# EAGLE design CoreLogger_TopLoadMicro_CD (EAGLE 9.3.0)

## Sheet 1 of 2
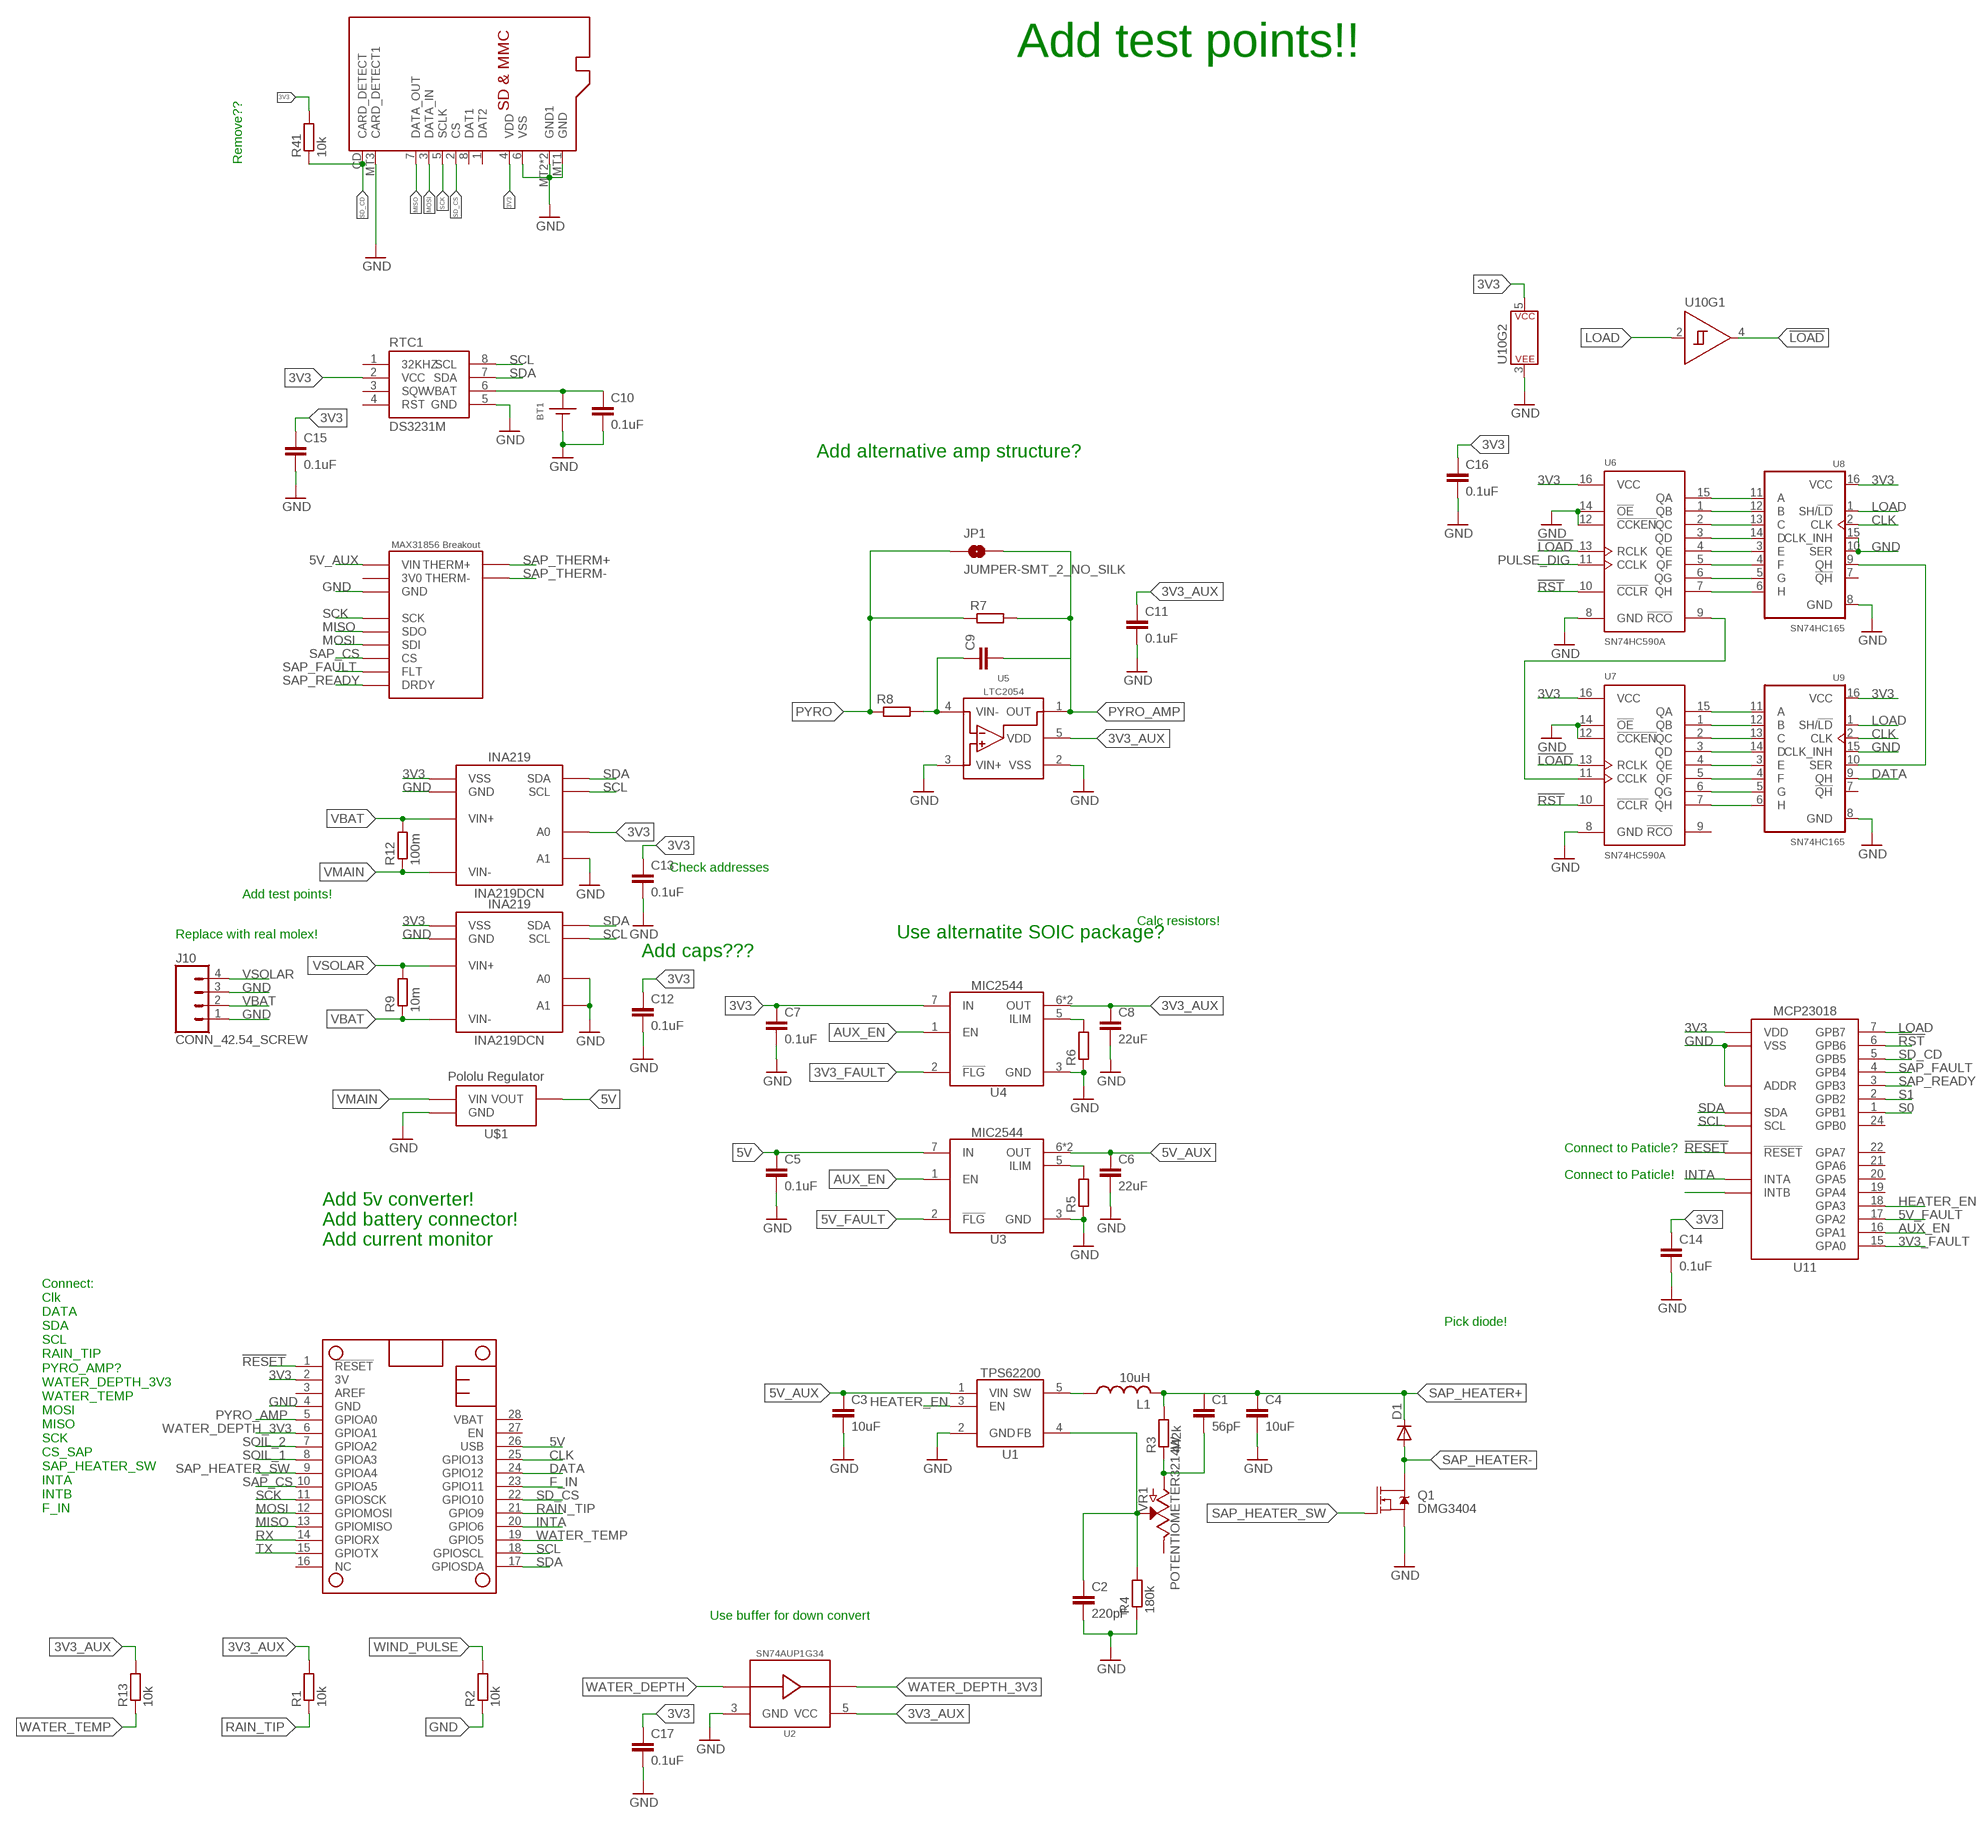
[diagram p0: schematic, sheet 1, part 1 of 2]
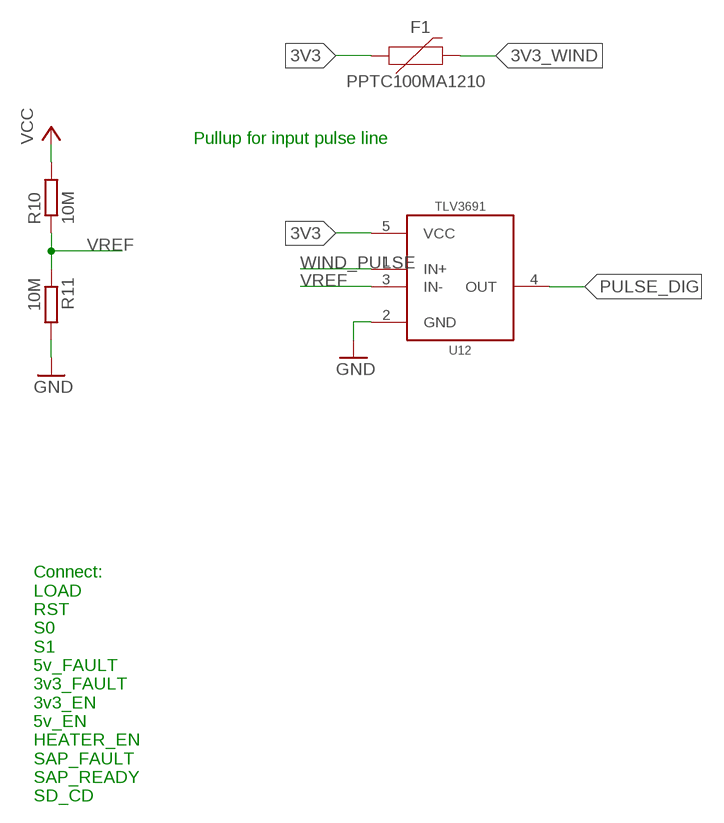
[diagram p1: schematic, sheet 1, part 2 of 2]

### Parts
BT1  BATTERY_COIN12MM  [LINX_BAT-HLD-012-SMT]
C1  56pF  C-EU56PFC0402  [C0402]
C2  220pF  C-EU220PFC0402  [C0402]
C3  10uF  C-EU10UFC0805  [C0805]
C4  10uF  C-EU10UFC0805  [C0805]
C5  0.1uF  C-EU0.1UFC0402  [C0402]
C6  22uF  C-EU22UFC0805  [C0805]
C7  0.1uF  C-EU0.1UFC0402  [C0402]
C8  22uF  C-EU22UFC0805  [C0805]
C9  C-EUC0603  [C0603]
C10  0.1uF  C-EU0.1UFC0603  [C0603]
C11  0.1uF  C-EU0.1UFC0402  [C0402]
C12  0.1uF  C-EU0.1UFC0402  [C0402]
C13  0.1uF  C-EU0.1UFC0402  [C0402]
C14  0.1uF  C-EU0.1UFC0402  [C0402]
C15  0.1uF  C-EU0.1UFC0402  [C0402]
C16  0.1uF  C-EU0.1UFC0402  [C0402]
C17  0.1uF  C-EU0.1UFC0402  [C0402]
D1  DIODESOD-123  [SOD-123]
F1  PPTC100MA1210  [1210_BOURNS]
J10  CONN_42.54_SCREW  [1X04_SCREW]
JP1  JUMPER-SMT_2_NO_SILK  [SMT-JUMPER_2_NO_SILK]
L1  10uH  INDUCTORLQS_4X4  [WE-LQS(4X4)]
MS1  FEATHERWING_NODIM  [FEATHERWING_DIM]
Q1  DMG3404  MOSFET-NCH-DMG3404L  [SOT23-3]
R1  10k  R-EU_10KR0603  [R0603]
R2  10k  R-EU_10KR0603  [R0603]
R3  442k  R-EU_R0603  [R0603]
R4  180k  R-EU_180KR0603  [R0603]
R5  R-EU_R0603  [R0603]
R6  R-EU_R0603  [R0603]
R7  R-EU_R0603  [R0603]
R8  R-EU_R0603  [R0603]
R9  10m  R-EU_R0805  [R0805]
R10  10M  R-EU_10MR0603  [R0603]
R11  10M  R-EU_10MR0603  [R0603]
R12  100m  R-EU_R0805  [R0805]
R13  10k  R-EU_10KR0603  [R0603]
R41  10k  R-EU_10KR0402  [R0402]
RTC1  DS3231M  [SO08]
SD1  MICROSDHINDGED  [MICROSD_HIROSE_HINDGED]
U1  TPS62200SOT23  [DBV0005A]
U2  SN74AUP1G34SC70  [DCK_R-PDSO-G5]
U3  MIC2544MSOP  [MSOP_8]
U4  MIC2544MSOP  [MSOP_8]
U5  LTC2054  [SOT23-5]
U6  SN74HC590AD  [SO16]
U7  SN74HC590AD  [SO16]
U8  SN74HC165D  [SO16]
U9  SN74HC165D  [SO16]
U10  SN74AUP1G14DCK  [DCK_R-PDSO-G5]
U11  MCP23018QFN  [QFN24]
U12  TLV3691DCK  [DCK_R-PDSO-G5]
U13  INA219DCN  [DCN_R-PDSO-G8]
U14  INA219DCN  [DCN_R-PDSO-G8]
U$1  POLOLU_REGULATOR  [U1V10FX_REGULATOR]
VR1  POTENTIOMETER3214W  [POT_3214W]
XU1  MAX31856_BREAKOUT  [MAX31856_BREAKOUT]

### Nets
3V3: C7.1 C12.1 C13.1 C14.1 C15.1 C16.1 C17.1 F1.1 MS1.2(3V) R10.2 R41.2 RTC1.2(VCC) SD1.4(VDD) U4.7(IN) U6.16(VCC) U7.16(VCC) U8.16(VCC) U9.16(VCC) U10.5(P$V+) U11.8(VDD) U12.5(VCC) U13.4(VSS) U14.4(VSS) U14.7(A0) ; supply symbol labelled VCC ; also sheet 2
3V3_AUX: C8.1 C11.1 R1.2 R13.2 U2.5(VCC) U4.6(OUT) U4.8(OUT) U5.5(VDD) ; also sheet 2
3V3_FAULT: U4.2(!FLG) U11.15(GPA0)
3V3_WIND: F1.2 ; also sheet 2
5V: C5.1 MS1.26(USB) U3.7(IN) U$1.VOUT
5V_AUX: C3.1 C6.1 U1.1(VIN) U3.6(OUT) U3.8(OUT) XU1.VIN ; also sheet 2
5V_FAULT: U3.2(!FLG) U11.17(GPA2)
!LOAD: U6.13(RCLK) U7.13(RCLK) U10.4(Y)
!RESET: MS1.1(!RESET) U11.12(!RESET)
!RST: U6.10(!CCLR) U7.10(!CCLR) U11.6(GPB6)
AUX_EN: U3.1(EN) U4.1(EN) U11.16(GPA1)
CLK: MS1.25(GPIO13) U8.2(CLK) U9.2(CLK)
DATA: MS1.24(GPIO12) U9.9(QH)
F_IN: MS1.23(GPIO11) ; also sheet 2
GND: BT1.GND(-) C2.2 C3.2 C4.2 C5.2 C6.2 C7.2 C8.2 C10.2 C11.2 C12.2 C13.2 C14.2 C15.2 C16.2 C17.2 J10.1 J10.3 MS1.4(GND) Q1.2(S) R2.1 R4.1 R5.1 R6.1 R11.2 RTC1.5(GND) SD1.6(VSS) SD1.MT1(GND) SD1.MT2(GND1) SD1.MT3(CARD_DETECT1) SD1.MT4(GND1) U1.2(GND) U2.3(GND) U3.3(GND) U4.3(GND) U5.2(VSS) U5.3(VIN+) U6.8(GND) U6.12(!CCKEN) U6.14(!OE) U7.8(GND) U7.12(!CCKEN) U7.14(!OE) U8.8(GND) U8.10(SER) U8.15(CLK_INH) U9.8(GND) U9.15(CLK_INH) U10.3(P$V-) U11.11(ADDR) U11.23(VSS) U12.2(GND) U13.3(GND) U13.7(A0) U13.8(A1) U14.3(GND) U14.8(A1) U$1.GND XU1.GND ; also sheet 2
HEATER_EN: U1.3(EN) U11.18(GPA3)
INTA: MS1.20(GPIO6) U11.14(INTA)
LOAD: U8.1(SH/!LD) U9.1(SH/!LD) U10.2(A) U11.7(GPB7)
MISO: MS1.13(GPIOMISO) SD1.7(DATA_OUT) XU1.SDO
MOSI: MS1.12(GPIOMOSI) SD1.3(DATA_IN) XU1.SDI
N$1: C1.2 R3.1 VR1.1(A)
N$2: C9.1 R8.2 U5.4(VIN-)
N$3: C2.1 R4.2 U1.4(FB) VR1.2(S)
N$4: R6.2 U4.5(ILIM)
N$5: R5.2 U3.5(ILIM)
N$6: L1.P$1 U1.5(SW)
N$7: U7.15(QA) U9.11(A)
N$8: U7.1(QB) U9.12(B)
N$9: U7.2(QC) U9.13(C)
N$10: U7.3(QD) U9.14(D)
N$11: U7.4(QE) U9.3(E)
N$12: U7.5(QF) U9.4(F)
N$13: U7.6(QG) U9.5(G)
N$14: U7.7(QH) U9.6(H)
N$15: U6.7(QH) U8.6(H)
N$16: U6.6(QG) U8.5(G)
N$17: U6.5(QF) U8.4(F)
N$18: U6.4(QE) U8.3(E)
N$19: U6.3(QD) U8.14(D)
N$20: U6.2(QC) U8.13(C)
N$21: U6.1(QB) U8.12(B)
N$22: U6.15(QA) U8.11(A)
N$23: U8.9(QH) U9.10(SER)
N$24: U6.9(!RCO) U7.11(CCLK)
N$26: U11.13(INTB)
N$30: BT1.POWER0(+) BT1.POWER1(+) C10.1 RTC1.6(VBAT)
PULSE_DIG: U6.11(CCLK) U12.4(OUT)
PYRO: JP1.1 R7.1 R8.1 ; also sheet 2
PYRO_AMP: C9.2 JP1.2 MS1.5(GPIOA0) R7.2 U5.1(OUT)
RAIN_TIP: MS1.21(GPIO9) R1.1 ; also sheet 2
RX: MS1.14(GPIORX) ; also sheet 2
S0: U11.1(GPB1) ; also sheet 2
S1: U11.2(GPB2) ; also sheet 2
SAP_CS: MS1.10(GPIOA5) XU1.CS
SAP_FAULT: U11.4(GPB4) XU1.FLT
SAP_HEATER+: C1.1 C4.1 D1.CAT(C) L1.P$2 R3.2 ; also sheet 2
SAP_HEATER-: D1.ANODE(A) Q1.3(D) ; also sheet 2
SAP_HEATER_SW: MS1.9(GPIOA4) Q1.1(G)
SAP_READY: U11.3(GPB3) XU1.DRDY
SAP_THERM+: XU1.THERM+ ; also sheet 2
SAP_THERM-: XU1.THERM- ; also sheet 2
SCK: MS1.11(GPIOSCK) SD1.5(SCLK) XU1.SCK
SCL: MS1.18(GPIOSCL) RTC1.8(SCL) U11.9(SCL) U13.5(SCL) U14.5(SCL) ; also sheet 2
SD_CD: R41.1 SD1.CD(CARD_DETECT) U11.5(GPB5)
SD_CS: MS1.22(GPIO10) SD1.2(CS)
SDA: MS1.17(GPIOSDA) RTC1.7(SDA) U11.10(SDA) U13.6(SDA) U14.6(SDA) ; also sheet 2
SOIL_1: MS1.8(GPIOA3) ; also sheet 2
SOIL_2: MS1.7(GPIOA2) ; also sheet 2
TX: MS1.15(GPIOTX) ; also sheet 2
VBAT: J10.2 R9.1 R12.2 U13.2(VIN-) U14.1(VIN+)
VMAIN: R12.1 U14.2(VIN-) U$1.VIN
VREF: R10.1 R11.1 U12.3(IN-)
VSOLAR: J10.4 R9.2 U13.1(VIN+)
WATER_DEPTH: U2.2(A) ; also sheet 2
WATER_DEPTH_3V3: MS1.6(GPIOA1) U2.4(Y)
WATER_TEMP: MS1.19(GPIO5) R13.1 ; also sheet 2
WIND_PULSE: R2.2 U12.1(IN+) ; also sheet 2
Unconnected: MS1.3(AREF) MS1.16(NC) MS1.27(EN) MS1.28(VBAT) RTC1.1(32KHZ) RTC1.3(SQW) RTC1.4(RST) SD1.1(DAT2) SD1.8(DAT1) U7.9(!RCO) U8.7(!QH) U9.7(!QH) U11.19(GPA4) U11.20(GPA5) U11.21(GPA6) U11.22(GPA7) U11.24(GPB0) VR1.3(E)

### Notes on the sheet
- Add test points!!
- Remove??
- Add alternative amp structure?
- Pullup for input pulse line
- Check addresses
- Add test points!
- Calc resistors!
- Replace with real molex! | Use alternatite SOIC package?
- Add caps???
- Connect to Paticle?
- Connect:
  LOAD
  RST
  S0
  S1
  5v_FAULT
  3v3_FAULT
  3v3_EN
  5v_EN
  HEATER_EN
  SAP_FAULT
  SAP_READY
  SD_CD
- Connect to Paticle!
- Add 5v converter!
  Add battery connector!
  Add current monitor
- Pick diode!
- Connect:
  Clk
  DATA
  SDA
  SCL
  RAIN_TIP
  PYRO_AMP?
  WATER_DEPTH_3V3
  WATER_TEMP
  MOSI
  MISO
  SCK
  CS_SAP
  SAP_HEATER_SW
  INTA
  INTB
  F_IN
- Use buffer for down convert

## Sheet 2 of 2
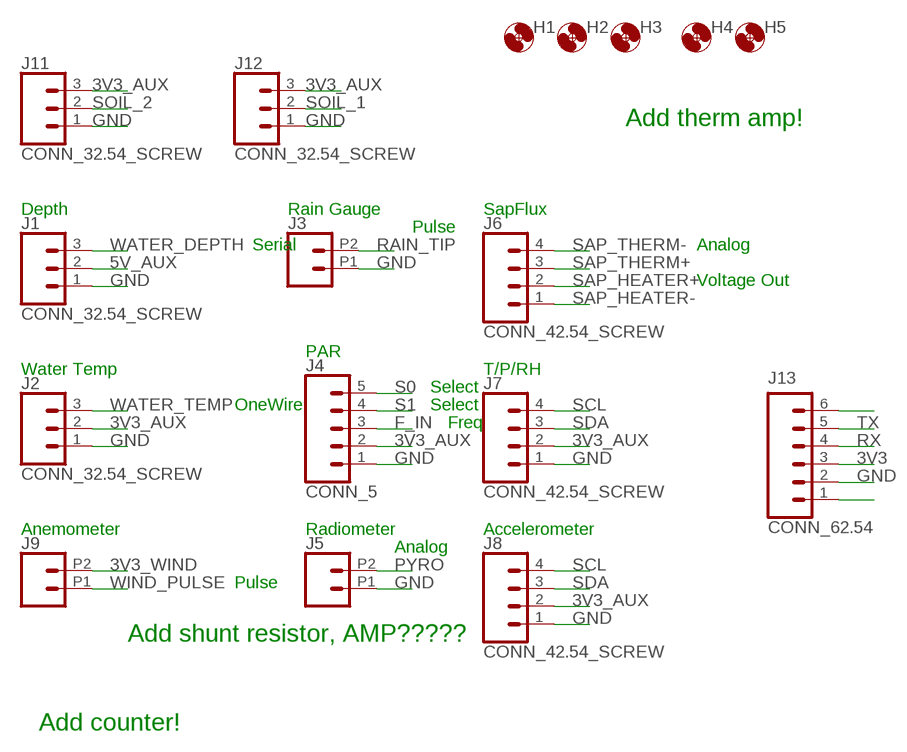
[diagram p2: schematic, sheet 2]

### Parts
H1  MOUNTING_HOLE4_NP  [4_40]
H2  MOUNTING_HOLE4_NP  [4_40]
H3  MOUNTING_HOLE4_NP  [4_40]
H4  MOUNTING_HOLE4_NP  [4_40]
H5  MOUNTING_HOLE4_NP  [4_40]
J1  CONN_32.54_SCREW  [1X03_SCREW]
J2  CONN_32.54_SCREW  [1X03_SCREW]
J3  CONN_022.54_SCREW  [1X02_2.54_SCREWTERM]
J4  CONN_5  [1X05]
J5  CONN_022.54_SCREW  [1X02_2.54_SCREWTERM]
J6  CONN_42.54_SCREW  [1X04_SCREW]
J7  CONN_42.54_SCREW  [1X04_SCREW]
J8  CONN_42.54_SCREW  [1X04_SCREW]
J9  CONN_022.54_SCREW  [1X02_2.54_SCREWTERM]
J11  CONN_32.54_SCREW  [1X03_SCREW]
J12  CONN_32.54_SCREW  [1X03_SCREW]
J13  CONN_62.54  [1X06]

### Nets
3V3: J13.3 ; also sheet 1
3V3_AUX: J2.2 J4.2 J7.2 J8.2 J11.3 J12.3 ; also sheet 1
3V3_WIND: J9.P2 ; also sheet 1
5V_AUX: J1.2 ; also sheet 1
F_IN: J4.3 ; also sheet 1
GND: J1.1 J2.1 J3.P1 J4.1 J5.P1 J7.1 J8.1 J11.1 J12.1 J13.2 ; also sheet 1
N$25: J13.6
N$32: J13.1
PYRO: J5.P2 ; also sheet 1
RAIN_TIP: J3.P2 ; also sheet 1
RX: J13.4 ; also sheet 1
S0: J4.5 ; also sheet 1
S1: J4.4 ; also sheet 1
SAP_HEATER+: J6.2 ; also sheet 1
SAP_HEATER-: J6.1 ; also sheet 1
SAP_THERM+: J6.3 ; also sheet 1
SAP_THERM-: J6.4 ; also sheet 1
SCL: J7.4 J8.4 ; also sheet 1
SDA: J7.3 J8.3 ; also sheet 1
SOIL_1: J12.2 ; also sheet 1
SOIL_2: J11.2 ; also sheet 1
TX: J13.5 ; also sheet 1
WATER_DEPTH: J1.3 ; also sheet 1
WATER_TEMP: J2.3 ; also sheet 1
WIND_PULSE: J9.P1 ; also sheet 1

### Notes on the sheet
- Add therm amp!
- Depth | Rain Gauge | SapFlux
- Pulse
- Serial | Analog
- Voltage Out
- PAR
- Water Temp | T/P/RH
- Select
- OneWire | Select
- Freq
- Anemometer | Radiometer | Accelerometer
- Analog
- Pulse
- Add shunt resistor, AMP?????
- Add counter!

## Power pins joined to a net without a drawn wire
3V0: XU1.3VO(3V0)

## Library data of the parts
BT1 = bschulz:BATTERY_COIN: Coin Cell Battery Holder; DIGIKEY: BAT-HLD-012-SMT-ND; MF: Linx; MPN: BAT-HLD-012-SMT
C1 = bschulz_passives:C-EU: CAPACITOR, European symbol; DIGIKEY: 311-1022-1-ND; MF: Yageo; MPN: CC0402JRNPO9BN560
C2 = bschulz_passives:C-EU: CAPACITOR, European symbol; DIGIKEY: 587-1215-1-ND; MF: Taiyo Yuden; MPN: UMK105CG221JV-F
C3 C4 = bschulz_passives:C-EU: CAPACITOR, European symbol; DIGIKEY: 490-6473-6-ND; MF: Murata; MPN: GRM21BR61C106KE15K
C5 C7 C11-C17 = bschulz_passives:C-EU: CAPACITOR, European symbol; DIGIKEY: 490-4759-1-ND; MF: Murata; MPN: GCM155R71C104KA55D
C6 C8 = bschulz_passives:C-EU: CAPACITOR, European symbol; DIGIKEY: 490-9952-1-ND; MF: Murata; MPN: GRM219R61C226ME15L
C9 = bschulz_passives:C-EU: CAPACITOR, European symbol
C10 = bschulz_passives:C-EU: CAPACITOR, European symbol; DIGIKEY: 490-6051-1-ND; MF: Murata; MPN: GCM188R71E104KA57D
D1 = bschulz:DIODE: Genaric Diode
F1 = bschulz:PPTC: Resettable Fuse PPTC Resettable Fuse. Really a sort of resistor with a polymeric positive temperature coefficient whose resistance increases dramatically with an increase in temperature. When heated by the power passing through the resistance rises causing the current to be limited, protecting the circuit. This is achieved by the transition of the polymer from a crystalline to an amorphous state where the conductive carbon separates breaking the conductive pathways found in the cool crystalline structure. When a PPTC cools back down it resumes conducting letting the circuit turn back on. SparkFun Products: SparkFun RedBoard - Programmed with Arduino <https://www.sparkfun.com/products/12757> Pro Micro - 5V/16MHz <https://www.sparkfun.com/products/12640> Arduino Pro 328 - 5V/16MHz <https://www.sparkfun.com/products/10915> MP3 Trigger <https://www.sparkfun.com/products/13720>; DIGIKEY: MF-USMF005-2CT-ND; MF: Bourns; MPN: MF-USMF005-2
H1-H5 = bschulz:MOUNTING_HOLE: Genaric Mechanical Mounting Hole Hole diameter based on max body diameter + 15% Keepout ring is for diameter of socket cap screw (minimum required clearance) TPlace ring is for diameter of pan head screw (recomended clearance) Specifications: Socket Cap <http://fastener-express.com/fastener-technical/SocketscapSS-Alloy.pdf> Button Head Socket Cap <http://fastener-express.com/fastener-technical/Button-Socket-alloy.pdf> Pan Head <http://fastener-express.com/fastener-technical/pan-machine-Screws.pdf>
J1 J2 J11 J12 = bschulz:CONN_3: Genaric 3 terminal header Digikey 2.54_SCREW <https://www.digikey.com/product-detail/en/on-shore-technology-inc/OSTVN03A150/ED10562-ND/1588863> 3.5_SCREW <https://www.digikey.com/product-detail/en/on-shore-technology-inc/OSTTE030161/ED2636-ND/614585>
J3 J5 J9 = bschulz:CONN_02: Genaric 2 terminal header SCREW_2.54 <https://www.digikey.com/product-detail/en/on-shore-technology-inc/OSTVN02A150/ED10561-ND/1588862>; DIGIKEY: ED10561-ND; MF: OnShore; MPN: OSTVN02A150
J4 = bschulz:CONN_5: Genaric 5 terminal header
J6-J8 J10 = bschulz:CONN_4: Genaric 4 terminal header Digikey 2.54_SCREW <https://www.digikey.com/product-detail/en/on-shore-technology-inc/OSTVN04A150/ED10563-ND/1588864>; DIGIKEY: ED10563-ND; MF: On Shore; MPN: OSTVN04A150
J13 = bschulz:CONN_6: Genaric 6 terminal header Digikey 2.54_SCREW <https://www.digikey.com/product-detail/en/on-shore-technology-inc/OSTVN06A150/ED10565-ND/1588866>
JP1 = SparkFun-Jumpers:JUMPER-SMT_2_NO: Normally open jumper This jumper has two pads in close proximity to each other. Apply solder to close the connection. Round pads are easier to solder for beginners, but are a lot larger. SparkFun Product that uses the round pads: SparkFun EL Sequencer <https://www.sparkfun.com/products/12781>
L1 = bschulz:INDUCTOR: Genaric inductor
MS1 = adafruit:FEATHERWING
Q1 = bschulz:MOSFET-NCH: N-channel MOSFETs Voltage controlled devices that allow control of high current outputs. SparkFun Products: SparkFun OpenScale <https://www.sparkfun.com/products/13261> SparkFun Digital Sandbox <https://www.sparkfun.com/products/12651> SparkFun Monster Moto Shield <https://www.sparkfun.com/products/10182> SparkFun MOSFET Power Controller <https://www.sparkfun.com/products/11214>; DIGIKEY: DMG3404L-7DICT-ND; MF: Diodes Incorporated; MPN: DMG3404L-7
R1 R2 R13 = bschulz_passives:R-EU_: RESISTOR, European symbol Digikey Parts: Yageo, 0402 <https://www.digikey.com/products/en/resistors/chip-resistor-surface-mount/52?k=&pkeyword=&sf=0&FV=ffec1104%2Cfffc000d%2C1c0002%2C440067%2C1f140000%2Cffe00034%2C400004&quantity=&ColumnSort=0&page=1&stock=1&pageSize=25> Yageo, 0603 <https://www.digikey.com/products/en/resistors/chip-resistor-surface-mount/52?k=&pkeyword=&s=4356&s=47360&sf=0&FV=fffc000d%2C1c0002%2C142c040c%2C1f140000%2Cffe00034&quantity=10&ColumnSort=1000011&page=1&stock=1&pageSize=25> Panasonic, 0603 <https://www.digikey.com/products/en/resistors/chip-resistor-surface-mount/52?k=&pkeyword=&pv252=68&sf=0&FV=ffec373d%2C1c0002%2C142c040c%2C1f140000%2Cffe00034%2C80002%2Cc0001&quantity=&ColumnSort=0&page=1&stock=1&pageSize=25> Panasonic, precision, 0603 <https://www.digikey.com/products/en/resistors/chip-resistor-surface-mount/52?FV=ffec4907%2Cfffc000a%2Cc0172%2C142c040c%2C1f140000%2Cffe00034%2C1c0002&quantity=100&ColumnSort=2085&page=1&stock=1&pageSize=25> Panasonic, 0805 <https://www.digikey.com/products/en/resistors/chip-resistor-surface-mount/52?k=&pkeyword=&pv3=1&sf=0&FV=ffec373d%2C1c0002%2C1f140000%2Cffe00034%2C142c040d&quantity=&ColumnSort=0&page=1&stock=1&pageSize=25> Rohm, current sense <https://www.digikey.com/products/en/resistors/chip-resistor-surface-mount/52?k=&pkeyword=&pv3=1&sf=0&FV=ffecb688%2C1f140000%2Cffe00034%2C1c0002&quantity=&ColumnSort=0&page=1&stock=1&pageSize=25> Vishay, pulse proof automotive <https://www.digikey.com/products/en/resistors/chip-resistor-surface-mount/52?k=&pkeyword=&pv7=2&sf=0&FV=ffec5d6b%2Cffe00034%2C1f140000&quantity=&ColumnSort=0&page=1&stock=1&pageSize=25>; DIGIKEY: 311-10.0KHRCT-ND; MF: Yageo; MPN: RC0603FR-0710KL; VALUE_PART: 10k
R3 R5-R8 = bschulz_passives:R-EU_: RESISTOR, European symbol Digikey Parts: Yageo, 0402 <https://www.digikey.com/products/en/resistors/chip-resistor-surface-mount/52?k=&pkeyword=&sf=0&FV=ffec1104%2Cfffc000d%2C1c0002%2C440067%2C1f140000%2Cffe00034%2C400004&quantity=&ColumnSort=0&page=1&stock=1&pageSize=25> Yageo, 0603 <https://www.digikey.com/products/en/resistors/chip-resistor-surface-mount/52?k=&pkeyword=&s=4356&s=47360&sf=0&FV=fffc000d%2C1c0002%2C142c040c%2C1f140000%2Cffe00034&quantity=10&ColumnSort=1000011&page=1&stock=1&pageSize=25> Panasonic, 0603 <https://www.digikey.com/products/en/resistors/chip-resistor-surface-mount/52?k=&pkeyword=&pv252=68&sf=0&FV=ffec373d%2C1c0002%2C142c040c%2C1f140000%2Cffe00034%2C80002%2Cc0001&quantity=&ColumnSort=0&page=1&stock=1&pageSize=25> Panasonic, precision, 0603 <https://www.digikey.com/products/en/resistors/chip-resistor-surface-mount/52?FV=ffec4907%2Cfffc000a%2Cc0172%2C142c040c%2C1f140000%2Cffe00034%2C1c0002&quantity=100&ColumnSort=2085&page=1&stock=1&pageSize=25> Panasonic, 0805 <https://www.digikey.com/products/en/resistors/chip-resistor-surface-mount/52?k=&pkeyword=&pv3=1&sf=0&FV=ffec373d%2C1c0002%2C1f140000%2Cffe00034%2C142c040d&quantity=&ColumnSort=0&page=1&stock=1&pageSize=25> Rohm, current sense <https://www.digikey.com/products/en/resistors/chip-resistor-surface-mount/52?k=&pkeyword=&pv3=1&sf=0&FV=ffecb688%2C1f140000%2Cffe00034%2C1c0002&quantity=&ColumnSort=0&page=1&stock=1&pageSize=25> Vishay, pulse proof automotive <https://www.digikey.com/products/en/resistors/chip-resistor-surface-mount/52?k=&pkeyword=&pv7=2&sf=0&FV=ffec5d6b%2Cffe00034%2C1f140000&quantity=&ColumnSort=0&page=1&stock=1&pageSize=25>; MF: Yageo
R4 = bschulz_passives:R-EU_: RESISTOR, European symbol Digikey Parts: Yageo, 0402 <https://www.digikey.com/products/en/resistors/chip-resistor-surface-mount/52?k=&pkeyword=&sf=0&FV=ffec1104%2Cfffc000d%2C1c0002%2C440067%2C1f140000%2Cffe00034%2C400004&quantity=&ColumnSort=0&page=1&stock=1&pageSize=25> Yageo, 0603 <https://www.digikey.com/products/en/resistors/chip-resistor-surface-mount/52?k=&pkeyword=&s=4356&s=47360&sf=0&FV=fffc000d%2C1c0002%2C142c040c%2C1f140000%2Cffe00034&quantity=10&ColumnSort=1000011&page=1&stock=1&pageSize=25> Panasonic, 0603 <https://www.digikey.com/products/en/resistors/chip-resistor-surface-mount/52?k=&pkeyword=&pv252=68&sf=0&FV=ffec373d%2C1c0002%2C142c040c%2C1f140000%2Cffe00034%2C80002%2Cc0001&quantity=&ColumnSort=0&page=1&stock=1&pageSize=25> Panasonic, precision, 0603 <https://www.digikey.com/products/en/resistors/chip-resistor-surface-mount/52?FV=ffec4907%2Cfffc000a%2Cc0172%2C142c040c%2C1f140000%2Cffe00034%2C1c0002&quantity=100&ColumnSort=2085&page=1&stock=1&pageSize=25> Panasonic, 0805 <https://www.digikey.com/products/en/resistors/chip-resistor-surface-mount/52?k=&pkeyword=&pv3=1&sf=0&FV=ffec373d%2C1c0002%2C1f140000%2Cffe00034%2C142c040d&quantity=&ColumnSort=0&page=1&stock=1&pageSize=25> Rohm, current sense <https://www.digikey.com/products/en/resistors/chip-resistor-surface-mount/52?k=&pkeyword=&pv3=1&sf=0&FV=ffecb688%2C1f140000%2Cffe00034%2C1c0002&quantity=&ColumnSort=0&page=1&stock=1&pageSize=25> Vishay, pulse proof automotive <https://www.digikey.com/products/en/resistors/chip-resistor-surface-mount/52?k=&pkeyword=&pv7=2&sf=0&FV=ffec5d6b%2Cffe00034%2C1f140000&quantity=&ColumnSort=0&page=1&stock=1&pageSize=25>; DIGIKEY: P180KHCT-ND; MF: Panasonic; MPN: ERJ-3EKF1803V; VALUE_PART: 180k
R9 R12 = bschulz_passives:R-EU_: RESISTOR, European symbol Digikey Parts: Yageo, 0402 <https://www.digikey.com/products/en/resistors/chip-resistor-surface-mount/52?k=&pkeyword=&sf=0&FV=ffec1104%2Cfffc000d%2C1c0002%2C440067%2C1f140000%2Cffe00034%2C400004&quantity=&ColumnSort=0&page=1&stock=1&pageSize=25> Yageo, 0603 <https://www.digikey.com/products/en/resistors/chip-resistor-surface-mount/52?k=&pkeyword=&s=4356&s=47360&sf=0&FV=fffc000d%2C1c0002%2C142c040c%2C1f140000%2Cffe00034&quantity=10&ColumnSort=1000011&page=1&stock=1&pageSize=25> Panasonic, 0603 <https://www.digikey.com/products/en/resistors/chip-resistor-surface-mount/52?k=&pkeyword=&pv252=68&sf=0&FV=ffec373d%2C1c0002%2C142c040c%2C1f140000%2Cffe00034%2C80002%2Cc0001&quantity=&ColumnSort=0&page=1&stock=1&pageSize=25> Panasonic, precision, 0603 <https://www.digikey.com/products/en/resistors/chip-resistor-surface-mount/52?FV=ffec4907%2Cfffc000a%2Cc0172%2C142c040c%2C1f140000%2Cffe00034%2C1c0002&quantity=100&ColumnSort=2085&page=1&stock=1&pageSize=25> Panasonic, 0805 <https://www.digikey.com/products/en/resistors/chip-resistor-surface-mount/52?k=&pkeyword=&pv3=1&sf=0&FV=ffec373d%2C1c0002%2C1f140000%2Cffe00034%2C142c040d&quantity=&ColumnSort=0&page=1&stock=1&pageSize=25> Rohm, current sense <https://www.digikey.com/products/en/resistors/chip-resistor-surface-mount/52?k=&pkeyword=&pv3=1&sf=0&FV=ffecb688%2C1f140000%2Cffe00034%2C1c0002&quantity=&ColumnSort=0&page=1&stock=1&pageSize=25> Vishay, pulse proof automotive <https://www.digikey.com/products/en/resistors/chip-resistor-surface-mount/52?k=&pkeyword=&pv7=2&sf=0&FV=ffec5d6b%2Cffe00034%2C1f140000&quantity=&ColumnSort=0&page=1&stock=1&pageSize=25>
R10 R11 = bschulz_passives:R-EU_: RESISTOR, European symbol Digikey Parts: Yageo, 0402 <https://www.digikey.com/products/en/resistors/chip-resistor-surface-mount/52?k=&pkeyword=&sf=0&FV=ffec1104%2Cfffc000d%2C1c0002%2C440067%2C1f140000%2Cffe00034%2C400004&quantity=&ColumnSort=0&page=1&stock=1&pageSize=25> Yageo, 0603 <https://www.digikey.com/products/en/resistors/chip-resistor-surface-mount/52?k=&pkeyword=&s=4356&s=47360&sf=0&FV=fffc000d%2C1c0002%2C142c040c%2C1f140000%2Cffe00034&quantity=10&ColumnSort=1000011&page=1&stock=1&pageSize=25> Panasonic, 0603 <https://www.digikey.com/products/en/resistors/chip-resistor-surface-mount/52?k=&pkeyword=&pv252=68&sf=0&FV=ffec373d%2C1c0002%2C142c040c%2C1f140000%2Cffe00034%2C80002%2Cc0001&quantity=&ColumnSort=0&page=1&stock=1&pageSize=25> Panasonic, precision, 0603 <https://www.digikey.com/products/en/resistors/chip-resistor-surface-mount/52?FV=ffec4907%2Cfffc000a%2Cc0172%2C142c040c%2C1f140000%2Cffe00034%2C1c0002&quantity=100&ColumnSort=2085&page=1&stock=1&pageSize=25> Panasonic, 0805 <https://www.digikey.com/products/en/resistors/chip-resistor-surface-mount/52?k=&pkeyword=&pv3=1&sf=0&FV=ffec373d%2C1c0002%2C1f140000%2Cffe00034%2C142c040d&quantity=&ColumnSort=0&page=1&stock=1&pageSize=25> Rohm, current sense <https://www.digikey.com/products/en/resistors/chip-resistor-surface-mount/52?k=&pkeyword=&pv3=1&sf=0&FV=ffecb688%2C1f140000%2Cffe00034%2C1c0002&quantity=&ColumnSort=0&page=1&stock=1&pageSize=25> Vishay, pulse proof automotive <https://www.digikey.com/products/en/resistors/chip-resistor-surface-mount/52?k=&pkeyword=&pv7=2&sf=0&FV=ffec5d6b%2Cffe00034%2C1f140000&quantity=&ColumnSort=0&page=1&stock=1&pageSize=25>; DIGIKEY: RMCF0603FT10M0CT-ND; MF: Stackpole; MPN: RMCF0603FT10M0; VALUE_PART: 10M
R41 = bschulz_passives:R-EU_: RESISTOR, European symbol Digikey Parts: Yageo, 0402 <https://www.digikey.com/products/en/resistors/chip-resistor-surface-mount/52?k=&pkeyword=&sf=0&FV=ffec1104%2Cfffc000d%2C1c0002%2C440067%2C1f140000%2Cffe00034%2C400004&quantity=&ColumnSort=0&page=1&stock=1&pageSize=25> Yageo, 0603 <https://www.digikey.com/products/en/resistors/chip-resistor-surface-mount/52?k=&pkeyword=&s=4356&s=47360&sf=0&FV=fffc000d%2C1c0002%2C142c040c%2C1f140000%2Cffe00034&quantity=10&ColumnSort=1000011&page=1&stock=1&pageSize=25> Panasonic, 0603 <https://www.digikey.com/products/en/resistors/chip-resistor-surface-mount/52?k=&pkeyword=&pv252=68&sf=0&FV=ffec373d%2C1c0002%2C142c040c%2C1f140000%2Cffe00034%2C80002%2Cc0001&quantity=&ColumnSort=0&page=1&stock=1&pageSize=25> Panasonic, precision, 0603 <https://www.digikey.com/products/en/resistors/chip-resistor-surface-mount/52?FV=ffec4907%2Cfffc000a%2Cc0172%2C142c040c%2C1f140000%2Cffe00034%2C1c0002&quantity=100&ColumnSort=2085&page=1&stock=1&pageSize=25> Panasonic, 0805 <https://www.digikey.com/products/en/resistors/chip-resistor-surface-mount/52?k=&pkeyword=&pv3=1&sf=0&FV=ffec373d%2C1c0002%2C1f140000%2Cffe00034%2C142c040d&quantity=&ColumnSort=0&page=1&stock=1&pageSize=25> Rohm, current sense <https://www.digikey.com/products/en/resistors/chip-resistor-surface-mount/52?k=&pkeyword=&pv3=1&sf=0&FV=ffecb688%2C1f140000%2Cffe00034%2C1c0002&quantity=&ColumnSort=0&page=1&stock=1&pageSize=25> Vishay, pulse proof automotive <https://www.digikey.com/products/en/resistors/chip-resistor-surface-mount/52?k=&pkeyword=&pv7=2&sf=0&FV=ffec5d6b%2Cffe00034%2C1f140000&quantity=&ColumnSort=0&page=1&stock=1&pageSize=25>; DIGIKEY: 311-10KJRCT-ND; MF: Yageo; MPN: RC0402JR-0710KL; VALUE_PART: 10k
RTC1 = bschulz:DS3231M: DS3231M Real Time Clock Accuracy +/-5ppm. Battery Backup. 2.3V to 5.5V. Datasheet <https://cdn.sparkfun.com/datasheets/Dev/Beagle/DS3231M.pdf> SparkFun Products CryptoCape <https://www.sparkfun.com/products/12773> (DEV-12773) SparkFun CryptoShield <https://www.sparkfun.com/products/13183> (DEV-13183); DIGIKEY: DS3231MZ+-ND; MF: Maxim; MPN: DS3231MZ+
SD1 = bschulz:MICROSD: Micro-SD / Transflash card holder with SPI pinout For the 3M # 2908-05WB-MG and/or 4UCON #19656 push-push type; DIGIKEY: HR1972CT-ND; MF: Hirose; MPN: DM3CS-SF
U1 = bschulz:TPS6220*: TPS6220x - High Efficiency Synchronous Step-Down Converter (Buck) Characteristics: Vin: 2.5V ~ 6V Vout: 0.7V ~ Vin (Fixed 1.2v, 1.5v, 1.6v, 1.8v, 1.875v, 2.5v, 3.3v) Output Current (max): 300mA IQ: 15μA (typ) Operating Temperature: -40°C to 85°C Digikey: 296-12716-1-ND (TPS62200, Adj) <https://www.digikey.com/product-detail/en/texas-instruments/TPS62200DBVR/296-12716-1-ND/461337>; DIGIKEY: 296-12716-1-ND; DISP: TPS62200; MF: TI; MPN: TPS62200DBVR
U2 = bschulz:SN74AUP1G34: SN74AUP1G34 - Logic Buffer Characteristics: VCC: 0.8~3.6V Operating Temperature: -40°C to 85°C Number of Gates: 1 /li> Inverting: No Digikey: 296-17230-1-ND (SC70, DCK) <https://www.digikey.com/product-detail/en/texas-instruments/SN74LVC1G34DCKR/296-17230-1-ND/669841>; DIGIKEY: 296-17230-1-ND; MF: TI; MPN: SN74LVC1G34DCKR
U3 U4 = bschulz:MIC2544: MIC2544/48 - Hight Side Load Switch, with Adjustable Current Limit Characteristics: Vin: 2.7v ~ 5.5v IQ: 1μA (OFF) RDS(ON): 80mΩ (Vin = 5v) Output Current: 1.5A (Max, limit adj) Operating Temperature: -40°C to 85°C Digikey: 576-1738-5-ND (Active High, MSOP) <https://www.digikey.com/product-detail/en/microchip-technology/MIC2544-1YMM/576-1738-5-ND/1028557> 576-1739-5-ND (Active Low, MSOP) <https://www.digikey.com/product-detail/en/microchip-technology/MIC2544-2YMM/576-1739-5-ND/1028565>; DIGIKEY: 576-1738-5-ND; MF: Microchip; MPN: MIC2544-1YMM
U5 = bschulz:LTC2054: LTC2054 -Single Micropower Zero Drift Op-Amp Characteristics: Vs: 2.7 ~ 6V (2.7 ~ +/- 5.5V for LTC2054HV) Iq: 175uA GBP: 500kHz PSSR: 130dB CMMR: 130dB Operating Temperature: -40°C to 85°C Digikey: LTC2054CS5#TRPBFCT-ND <https://www.digikey.com/scripts/DkSearch/dksus.dll?Detail&itemSeq=258611552&uq=636603257096973101> LTC2054HVIS5#TRMPBFCT-ND (High Voltage Variant) <https://www.digikey.com/product-detail/en/linear-technology-analog-devices/LTC2054HVIS5-TRMPBF/LTC2054HVIS5-TRMPBFCT-ND/3830416>; DIGIKEY: LTC2054HS5#TRMPBFCT-ND; DISP: LTC2054; MF: LT; MPN: LTC2054HS5#TRMPBF
U6 U7 = bschulz:SN74HC590A: SN74HC590A - 8 bit binary counter with direct clear Characteristics: VCC: 2~6V Operating Temperature: -40°C to 85°C fmax = 2.5 MHz (for Vcc = 2v, high for higher Vcc) Digikey: 296-8340-5-ND (SOIC) <https://www.digikey.com/product-detail/en/texas-instruments/SN74HC590AD/296-8340-5-ND/376756> 296-1599-5-ND (DIP) <https://www.digikey.com/product-detail/en/texas-instruments/SN74HC590AN/296-1599-5-ND/277245>; DIGIKEY: 296-8340-5-ND; MF: TI; MPN: SN74HC590AD
U8 U9 = bschulz:SN74HC165: SN74HC165 - 8 bit PISO shift register Characteristics: VCC: 2~6V Operating Temperature: -40°C to 85°C fmax = 2.5 MHz (for Vcc = 2v, high for higher Vcc) Digikey: 296-8253-1-ND (TSSOP) <https://www.digikey.com/product-detail/en/texas-instruments/SN74HC165PWR/296-8253-1-ND/376670> 296-8250-1-ND (SOIC) <https://www.digikey.com/product-detail/en/texas-instruments/SN74HC165DR/296-8250-1-ND/405259> 296-8251-5-ND (DIP) <https://www.digikey.com/product-detail/en/texas-instruments/SN74HC165N/296-8251-5-ND/376966>; DIGIKEY: 296-8250-1-ND; MF: TI; MPN: SN74HC165DR
U10 = bschulz:SN74*1G14: SN74x1G14 - Single Schmitt Triger Inverter Characteristics: VCC: 0.8 ~ 3.6V (1.65 ~ 5.5V for LVC Version) Operating Temperature: -40°C to 85°C (-40°C to 125°C for LVC Version) fmax = 2.5 MHz (for Vcc =1.65v, high for higher Vcc) Output Current = ± 4 mA (± 32 mA for LVC Version) Digikey: 296-19076-1-ND (AUP Low Voltage) <https://www.digikey.com/product-detail/en/texas-instruments/SN74AUP1G14DCKR/296-19076-1-ND/864307> 296-47215-1-ND (LVC High Voltage) <https://www.digikey.com/product-detail/en/texas-instruments/SN74LVC1G14DCKR/296-11608-1-ND/385747>; DIGIKEY: 296-19076-1-ND; MF: TI; MPN: SN74AUP1G14DCKR
U11 = bschulz:MCP23018: MCP23018 - I2C I/O Expander, 16 bit wtih interrupt and reset Characteristics: Vcc: 1.8V ~ 5.5V IOut: 25 mA IQ: 1μA Operating Temperature: -40°C to 85°C Internal Configurable Pullups Digikey: MCP23018T-E/MJCT-ND (QFN) <https://www.digikey.com/products/en/integrated-circuits-ics/interface-i-o-expanders/749?k=mcp23018&k=&pkeyword=mcp23018&sv=0&pv1291=4438&sf=0&FV=ffe002ed%2C1c0002%2C1140003&quantity=&ColumnSort=0&page=1&stock=1&pageSize=25>; DIGIKEY: MCP23018T-E/MJCT-ND; MF: TI; MPN: MCP23018T-E/MJ
U12 = bschulz:TLV3691: TLV3691 - Nanopower Analog Comparator Characteristics: Vin: 0.9V ~ 6.5V (± 0.45V ~ ± 3.25V) Response Time: 24us Push-Pull Output IQ: 75nA Operating Temperature: -40°C to 125°C Digikey: 296-37910-1-ND (DCK) <https://www.digikey.com/products/en/integrated-circuits-ics/linear-comparators/692?k=TLV3691&k=&pkeyword=TLV3691&sv=0&pv7=2&sf=0&FV=142c0371%2Cffe002b4&quantity=&ColumnSort=1000011&page=1&stock=1&pageSize=25> 296-37242-6-ND (DPF) <https://www.digikey.com/product-detail/en/texas-instruments/TLV3691IDPFR/296-37242-6-ND/4695352>; DIGIKEY: 296-37910-1-ND; MF: TI; MPN: TLV3691IDCKR
U13 U14 = bschulz:INA219: INA219 - Zero Drift Bidirectional Current/Power Monitor with I2C Interface Characteristics: Vcc: 3V ~ 5.5V Iq: 700uA Common Mode Range: 0V ~ 26V Operating Temperature: -40°C to 125°C Digikey: SOIC (D) <https://www.digikey.com/product-detail/en/texas-instruments/INA219AIDR/296-23978-1-ND/1984895> SOT-23 (DCN) <https://www.digikey.com/product-detail/en/texas-instruments/INA219AIDCNR/296-23770-1-ND/1952550>; DIGIKEY: 296-23770-1-ND; MF: TI; MPN: INA219AIDCNR
U$1 = LEAF_Components:POLOLU_REGULATOR
VR1 = bschulz:POTENTIOMETER: Genaric potentiometer
XU1 = LEAF_Components:MAX31856_BREAKOUT: Socket for MAX31856 Breakout from Adafruit Adafruit Board <https://www.adafruit.com/product/3263>

## Board
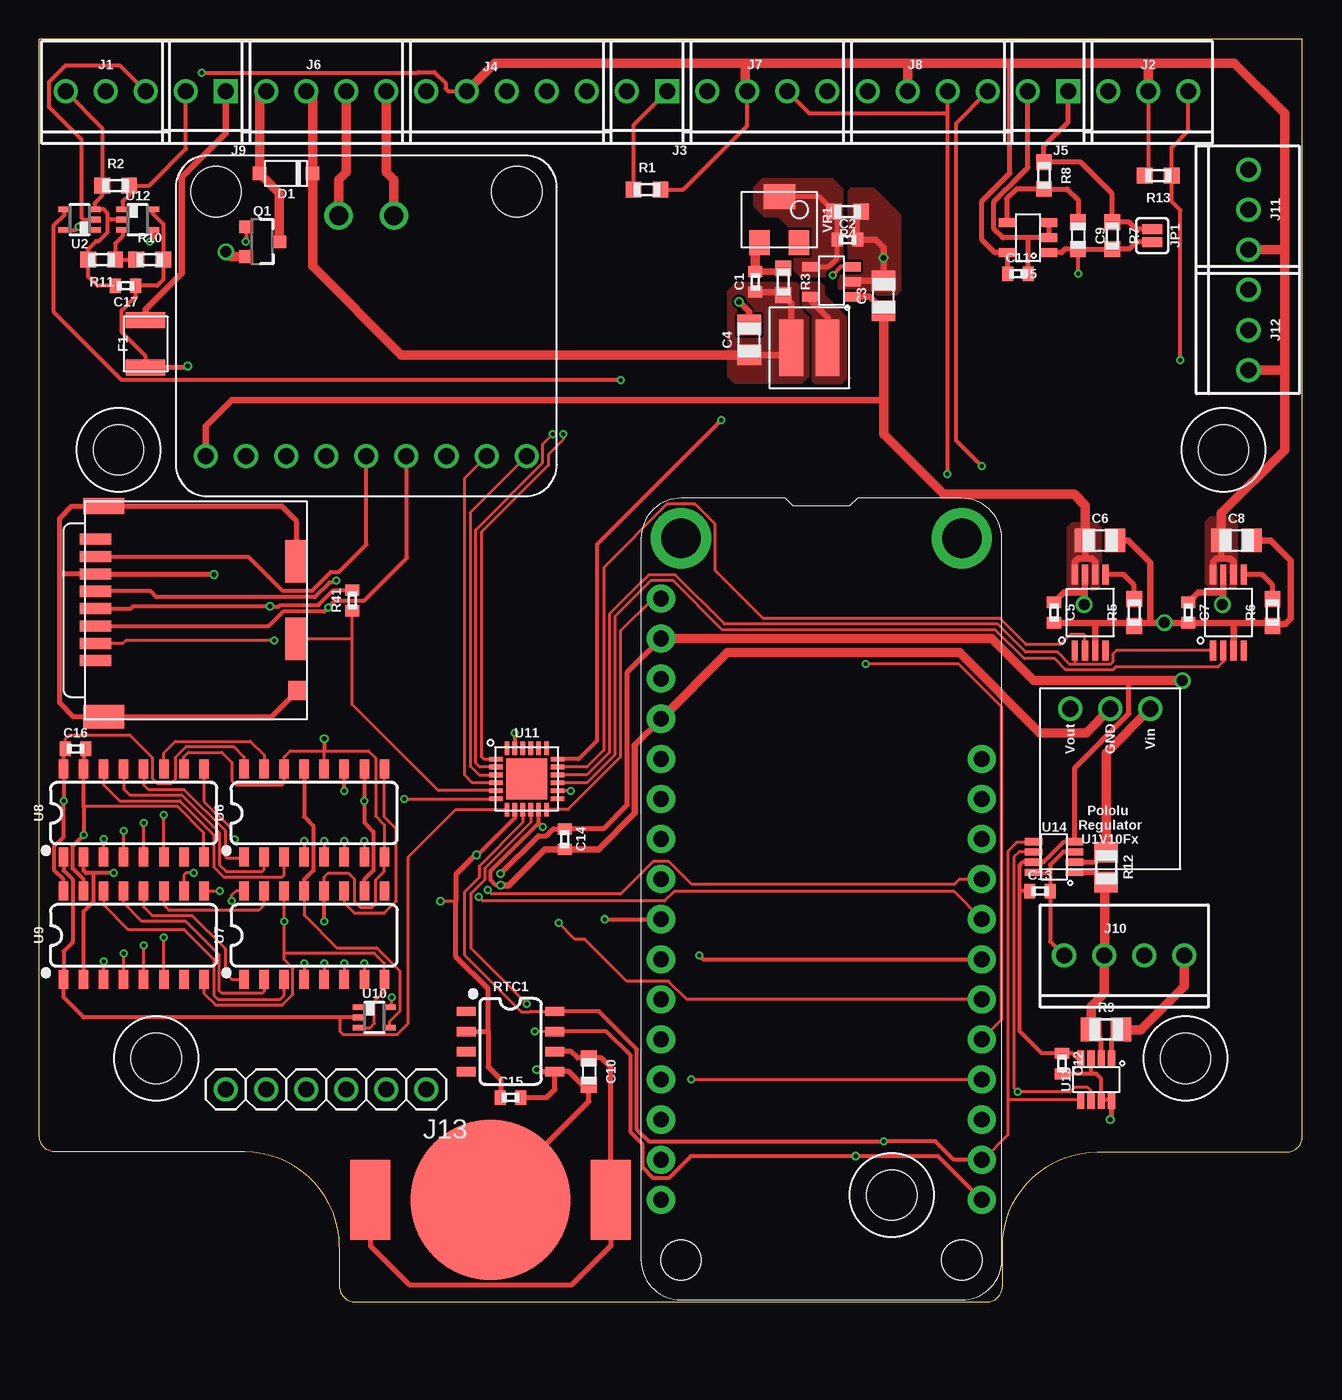
[diagram p3: board, top side]
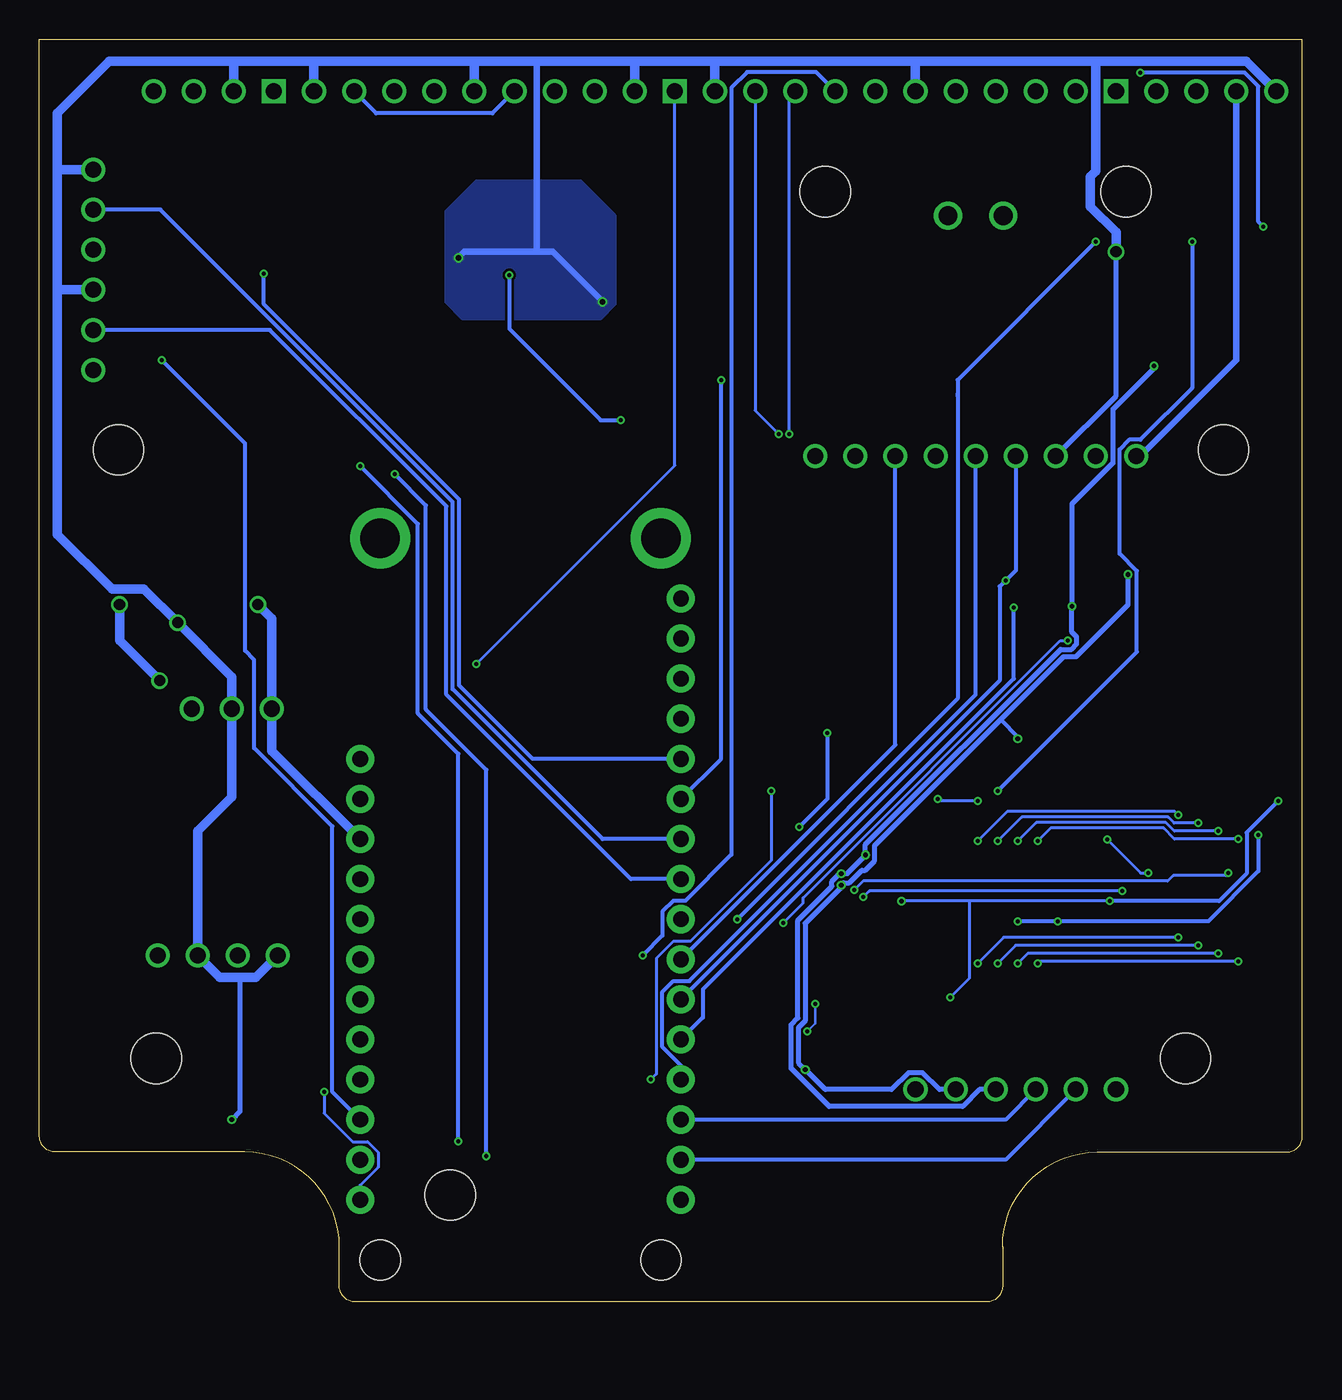
[diagram p4: board, bottom side, seen from below]

Size 80 x 80 mm. Coordinates in mm from the lower left corner, seen from the top.
Outline: 80,80 0,80 0,10.5 arc90 1,9.5 13,9.5 arc-90 19,3.5 19,1 arc90 20,0 60,0 arc90 61,1 61,3.5 arc-90 67,9.5 79,9.5 arc90 80,10.5 80,80
Copper layers (1*16): Top 0.035559375mm / dielectric 1.6mm / Bottom 0.035559375mm
Design rules "oshpark-2layer *": minimum track width 6mil, minimum drill 10mil, track to track 6mil, track to pad 6mil, pad to pad 6mil, via to via 6mil, smd to smd 6mil, copper to edge 15mil, drill to drill 6mil, minimum pad ring 5mil, minimum via ring 5mil, stop-mask expansion 2.5mil, vias tented up to drill 0mil, thermal gap 10mil

### Footprints (pad centres in the part's own frame; a part is rotated, then mirrored left to right if it is on the bottom)
LINX_BAT-HLD-012-SMT = smd 10.16 x 10.16: GND 0,0 | smd 2.54 x 5.08: POWER0 -7.62,0; POWER1 7.62,0
C0402 = smd 0.7 x 0.9: 1 -0.65,0; 2 0.65,0
C0805 = smd 1.3 x 1.5: 1 -0.95,0; 2 0.95,0
C0603 = smd 1 x 1: 1 -0.85,0; 2 0.85,0
SOD-123 = smd 0.85 x 0.85: ANODE 1.675,0; CAT -1.675,0
1210_BOURNS = smd 1 x 2.5: 1 -1.5,0; 2 1.5,0
4_40 = hole 3.175: 0,0
1X03_SCREW = drill 1.016: 1 -2.54,0; 2 0,0; 3 2.54,0
1X02_2.54_SCREWTERM = drill 1.016: P1 1.27,0 | drill 1.016 square: P2 -1.27,0
1X05 = drill 1.016: 1 -3.81,0; 2 -1.27,0; 3 1.27,0; 4 3.81,0; 5 6.35,0
1X04_SCREW = drill 1.016: 1 -3.81,0; 2 -1.27,0; 3 1.27,0; 4 3.81,0
1X06 = drill 1.016: 1 -6.35,0; 2 -3.81,0; 3 -1.27,0; 4 1.27,0; 5 3.81,0; 6 6.35,0
SMT-JUMPER_2_NO_SILK = smd 0.635 x 1.27: 1 -0.406,0; 2 0.406,0
WE-LQS(4X4) = smd 1.5 x 3.6: P$1 -1.15,0; P$2 1.15,0
FEATHERWING_DIM = drill 1 pad 1.778: 1 6.35,1.27; 2 8.89,1.27; 3 11.43,1.27; 4 13.97,1.27; 5 16.51,1.27; 6 19.05,1.27; 7 21.59,1.27; 8 24.13,1.27; 9 26.67,1.27; 10 29.21,1.27; 11 31.75,1.27; 12 34.29,1.27; 13 36.83,1.27; 14 39.37,1.27; 15 41.91,1.27; 16 44.45,1.27; 17 44.45,21.59; 18 41.91,21.59; 19 39.37,21.59; 20 36.83,21.59; 21 34.29,21.59; 22 31.75,21.59; 23 29.21,21.59; 24 26.67,21.59; 25 24.13,21.59; 26 21.59,21.59; 27 19.05,21.59; 28 16.51,21.59 | drill 2.5 pad 3.81: P$1 2.54,20.32; P$2 2.54,2.54 | hole 2.54: 48.26,20.32; 48.26,2.54
SOT23-3 = smd 0.8 x 0.9: 1 -0.95,-1; 2 0.95,-1; 3 0,1.1
R0603 = smd 1 x 1: 1 -0.85,0; 2 0.85,0
R0805 = smd 1.3 x 1.5: 1 -0.95,0; 2 0.95,0
R0402 = smd 0.7 x 0.9: 1 -0.65,0; 2 0.65,0
SO08 = smd 0.6 x 1.2: 1 -1.905,-2.8; 2 -0.635,-2.8; 3 0.635,-2.8; 4 1.905,-2.8; 5 1.905,2.8; 6 0.635,2.8; 7 -0.635,2.8; 8 -1.905,2.8
MICROSD_HIROSE_HINDGED = smd 0.7 x 2: 1 3.2,0.7; 2 2.1,0.7; 3 1,0.7; 4 -0.1,0.7; 5 -1.2,0.7; 6 -2.3,0.7; 7 -3.4,0.7; 8 -4.5,0.7 | smd 2.7 x 1.4: CD 1.8,13.4; MT3 -3.1,13.4 | smd 1.5 x 2.6: MT1 6.75,1.2 | smd 1.2 x 1.2: MT2 5.08,13.5 | smd 1 x 2.6: MT4 -6.6,1.2
DBV0005A = smd 1.1 x 0.6: 1 -1.3,0.95; 2 -1.3,0; 3 -1.3,-0.95; 4 1.3,-0.95; 5 1.3,0.95
DCK_R-PDSO-G5 = smd 0.35 x 0.8: 1 -0.65,-0.95; 2 0,-0.95; 3 0.65,-0.95; 4 0.65,0.95; 5 -0.65,0.95
MSOP_8 = smd 1.26 x 0.4: 1 -2.4,0.975; 2 -2.4,0.325; 3 -2.4,-0.325; 4 -2.4,-0.975; 5 2.4,-0.975; 6 2.4,-0.325; 7 2.4,0.325; 8 2.4,0.975
SOT23-5 = smd 0.55 x 1: 1 -0.95,-1.35; 2 0,-1.35; 3 0.95,-1.35; 4 0.95,1.35; 5 -0.95,1.35
SO16 = smd 0.6 x 1.2: 1 -4.445,-2.8; 2 -3.175,-2.8; 3 -1.905,-2.8; 4 -0.635,-2.8; 5 0.635,-2.8; 6 1.905,-2.8; 7 3.175,-2.8; 8 4.445,-2.8; 9 4.445,2.8; 10 3.175,2.8; 11 1.905,2.8; 12 0.635,2.8; 13 -0.635,2.8; 14 -1.905,2.8; 15 -3.175,2.8; 16 -4.445,2.8
QFN24 = smd 0.85 x 0.3: 1 -1.95,1.25; 2 -1.95,0.75; 3 -1.95,0.25; 4 -1.95,-0.25; 5 -1.95,-0.75; 6 -1.95,-1.25; 13 1.95,-1.25; 14 1.95,-0.75; 15 1.95,-0.25; 16 1.95,0.25; 17 1.95,0.75; 18 1.95,1.25 | smd 0.3 x 0.85: 7 -1.25,-1.95; 8 -0.75,-1.95; 9 -0.25,-1.95; 10 0.25,-1.95; 11 0.75,-1.95; 12 1.25,-1.95; 19 1.25,1.95; 20 0.75,1.95; 21 0.25,1.95; 22 -0.25,1.95; 23 -0.75,1.95; 24 -1.25,1.95 | smd 2.6 x 2.6: EP 0,0
DCN_R-PDSO-G8 = smd 0.45 x 1.1: 1 -0.975,-1.3; 2 -0.325,-1.3; 3 0.325,-1.3; 4 0.975,-1.3; 5 0.975,1.3; 6 0.325,1.3; 7 -0.325,1.3; 8 -0.975,1.3
U1V10FX_REGULATOR = drill 1.016: GND 0,-4.445; VIN -2.54,-4.445; VOUT 2.54,-4.445
POT_3214W = smd 1.6 x 1.3: 1 1.45,-1.25; 3 1.45,1.25 | smd 1.6 x 2: 2 -1.45,0
MAX31856_BREAKOUT = drill 1.016: 3VO -7.62,0; CS 5.08,0; DRDY 10.16,0; FLT 7.62,0; GND -5.08,0; SCK -2.54,0; SDI 2.54,0; SDO 0,0; VIN -10.16,0 | drill 1.2: THERM+ -1.75,15.24; THERM- 1.75,15.24 | hole 3.175: -9.525,16.764; 9.525,16.764

### Placement (x,y rotation side)
BT1  28.57,6.48 180 top
C1  45.34,64.64 90 top
C2  51.18,67.31 0 top
C3  53.47,63.75 90 top
C4  44.96,60.96 90 top
C5  64.26,43.69 270 top
C6  67.18,48.26 0 top
C7  72.77,43.69 270 top
C8  75.82,48.26 0 top
C9  65.79,67.56 270 top
C10  34.8,14.61 270 top
C11  61.98,65.15 0 top
C12  64.77,15.11 270 top
C13  63.37,26.04 0 top
C14  33.27,29.34 270 top
C15  29.84,12.95 0 top
C16  2.29,35.05 0 top
C17  5.46,64.39 180 top
D1  15.62,71.5 180 top
F1  6.73,60.71 90 top
H1  7.4,15.44 0 top
H2  72.6,15.44 0 top
H3  53.98,6.78 0 top
H4  5,54 0 top
H5  75,54 0 top
J1  4.19,76.71 0 top
J2  70.23,76.71 0 top
J3  38.48,76.71 180 top
J4  28.32,76.71 0 top
J5  63.88,76.71 180 top
J6  18.16,76.71 0 top
J7  46.1,76.71 0 top
J8  56.26,76.71 0 top
J9  10.54,76.71 180 top
J10  68.71,21.97 0 top
J11  76.58,69.22 270 top
J12  76.58,61.59 270 top
J13  18.16,13.46 180 top
JP1  70.48,67.56 270 top
L1  48.77,60.45 180 top
MS1  38.1,50.93 270 top
Q1  14.1,67.18 270 top
R1  38.48,70.48 0 top
R2  4.83,70.74 0 top
R3  47.12,64.64 270 top
R4  51.18,69.09 180 top
R5  69.34,43.69 90 top
R6  78.11,43.69 90 top
R7  67.94,67.56 270 top
R8  63.63,71.37 270 top
R9  67.56,17.27 0 top
R10  6.99,66.04 0 top
R11  3.94,66.04 180 top
R12  67.56,27.56 270 top
R13  70.87,71.37 180 top
R41  19.81,44.45 90 top
RTC1  29.84,16.51 270 top
SD1  2.86,43.83 270 top
U1  50.16,64.64 180 top
U2  2.54,68.58 90 top
U3  66.55,43.69 90 top
U4  75.31,43.69 90 top
U5  62.61,67.44 90 top
U6  17.4,30.99 0 top
U7  17.4,23.24 0 top
U8  5.97,30.99 0 top
U9  5.97,23.24 0 top
U10  21.21,18.03 270 top
U11  30.86,33.15 0 top
U12  6.22,68.58 270 top
U13  66.93,14.1 180 top
U14  64.26,28.19 90 top
U$1  67.82,33.15 180 top
VR1  46.86,68.58 270 top
XU1  20.7,53.59 0 top

### Tracks (layer width: path | path; a pad name or v marks a point on that pad's centre or on a via)
3V3  (via drill 0.25, 0.3, 0.7)
  Top 0.2: U6.16 12.95,34.55 12.32,35.18 9.28,35.18 8.59,34.49 8.59,33.1 8.32,32.84 7.49,32.84 7.16,33.17 7.16,34.5 5.71,35.94 1.91,35.94 1.64,35.67 C16.1 | U10.5 22.3,18.83 v22.3,19.3 | v12.19,25.4 12.19,25.78 12.45,26.04 U7.16 | v25.4,25.4 26.38,25.4
  Top 0.254: U14.4 64.92,29.17 63.62,27.87 U14.7 62.28,27.87 62.1,27.69 62.1,26.04 | U11.8 30.11,30.66 27.77,28.32 v27.69,28.32 | U9.16 1.52,26.77 0.94,27.34 0.94,28.9 1.52,29.48 v1.52,31.75 U8.16 1.52,34.94 C16.1 | R10.2 8.13,66.33 | R10.2 7.85,66.06 7.85,68.3 7.17,68.98 U12.5 | F1.1 6.73,59.93 5.2,61.46 5.2,62.82 6.11,63.73 C17.1 7.45,64.39 7.83,64.77 R10.2 | R41.2 18.62,45.1 17.67,44.16 15.26,44.16 15.19,44.08 v14.61,44.08 5.92,44.08 5.77,43.93 SD1.4 | 62.1,26.04 62.1,17.15 63.48,15.76 C12.1 65.41,15.76 65.77,15.4 U13.4 | C13.1 62.1,26.04
  Top 0.305: MS1.2 37.21,39.87 37.21,31.49 35.7,29.99 C14.1 32.55,29.99 32.11,29.54 31.61,29.54 v29.21,27.14 | v27.69,28.32 27.61,28.32 26.38,27.09 26.38,25.4 26.38,21.88 28.41,19.85 28.41,17.14 | 69.01,39.37 69.01,37.28 65.56,33.83 U14.4 | v9.4,59.31 9.29,59.21 F1.1 | C15.1 29.21,12.97 29.21,14.1 28.41,14.89 28.41,17.14 | RTC1.2 28.41,17.14
  Top 0.406: U4.7 74.99,44.96 | 74.99,44.96 74.99,44.25 v74.93,44.2 | C7.1 73.39,44.96 74.99,44.96
  Top 0.61: MS1.2 60.33,42.04 62.99,39.37 69.01,39.37 v72.39,39.37
  Bottom 0.2: v22.3,19.3 21.08,20.53 21.08,25.4 | v12.19,25.4 21.08,25.4 | 21.08,25.4 v25.4,25.4
  Bottom 0.254: v12.19,25.4 5.28,25.4 3.53,27.15 3.53,29.74 v1.52,31.75
  Bottom 0.305: v9.4,59.31 9.4,59.17 12.01,56.55 12.01,53.15 14.61,50.56 v14.61,44.08 14.61,42.45 14.3,42.14 14.3,41.68 14.63,41.35 15.31,41.35 27.69,28.98 v27.69,28.32 27.69,28.28 28.83,27.14 v29.21,27.14 29.31,27.14 29.8,26.65 29.8,26.34 31.96,24.18 31.96,17.99 32.38,17.57 32.38,14.8 29.98,12.39 21.53,12.39 20.46,13.46 J13.3
  Bottom 0.61: v72.39,39.37 74.93,41.91 v74.93,44.2
3V3_AUX  (via drill 0.25)
  Top 0.254: R1.2 40.77,70.48 44.83,74.55 J7.2 | J2.2 70.23,71.59 R13.2 | U2.5 2.27,67.93 v2.48,68.14 | v10.29,77.9 23.98,77.9 24.01,77.93 25.02,77.93 25.73,77.21 25.73,76.89 25.91,76.71 J4.2
  Top 0.305: C11.1 61.33,66.42 U5.5 60.51,66.49 59.69,67.31 59.69,69.74 61.47,71.52 61.47,78.49
  Top 0.406: U4.8 74.34,46.9 74.55,47.12 74.93,47.12 | 74.93,47.12 75.44,47.12 75.64,46.92 U4.6 | C8.1 74.87,47.18 74.93,47.12
  Top 0.61: C8.1 74.87,49.98 78.87,53.98 78.87,59.05 | 78.87,59.05 78.87,66.67 | 78.87,66.67 78.87,75.31 75.69,78.49 70.23,78.49 | 54.99,78.49 44.7,78.49 | J7.2 44.7,76.83 44.7,78.49 | J2.2 70.23,78.49 | J11.3 78.87,66.67 | J12.3 78.87,59.05 | J8.2 54.99,78.49 | J4.2 28.83,78.49 44.7,78.49 | 54.99,78.49 61.47,78.49 70.23,78.49
  Bottom 0.254: v2.48,68.14 2.79,68.45 2.79,77.03 3.67,77.9 v10.29,77.9
  pour Top (no thermals): 73.91,49.4 73.91,45.59 74.17,45.34 75.69,45.34 75.82,45.47 75.82,49.4 75.56,49.66 74.17,49.66
3V3_FAULT
  Top 0.2: U4.2 74.99,40.57 74.68,40.26 68.18,40.26 67.97,40.05 65.01,40.05 64.3,40.77 62.38,40.77 60.56,42.59 43.26,42.59 40.13,45.72 38.73,45.72 36.45,43.43 36.45,34.67 34.67,32.89 U11.15
3V3_WIND
  Top 0.406: F1.2 6.73,62.92 9,65.2 9,71.26 11.81,74.06 J9.P2
5V  (via drill 0.7)
  Top 0.406: U3.7 66.22,44.96 | 66.22,44.96 66.22,44.25 v66.17,44.2 | C5.1 64.88,44.96 66.22,44.96
  Bottom 0.61: MS1.26 65.28,34.92 U$1.VOUT 65.28,43.31 v66.17,44.2
5V_AUX
  Top 0.406: U3.8 65.57,46.9 65.79,47.12 66.17,47.12 | U3.6 66.87,46.92 66.67,47.12 66.17,47.12 | C6.1 66.23,47.18 66.17,47.12 | 53.47,57.15 12.19,57.15 10.54,55.5 XU1.VIN | U1.1 52.58,63.69 C3.1
  Top 0.61: C6.1 66.23,50.48 65.53,51.18 57.28,51.18 53.47,54.99 53.47,57.15 C3.1
  Bottom 0.406: XU1.VIN 10.29,53.59 4.19,59.69 J1.2
  pour Top (no thermals): 65.15,49.02 65.15,45.47 65.41,45.21 66.93,45.21 67.18,45.47 67.18,49.02 66.93,49.28 65.41,49.28
5V_FAULT
  Top 0.2: U3.2 66.22,42.23 66.17,42.29 65.28,42.29 64.64,41.66 62.49,41.66 60.85,43.3 45.85,43.3 42.8,46.36 42.8,49.28 41.53,50.54 39.75,50.54 35.74,46.54 35.74,34.96 34.68,33.9 U11.17
!LOAD
  Top 0.2: U7.13 16.76,24.51 18.82,22.45 21.36,22.45 22.81,20.99 22.81,18.4 22.16,17.75 U10.4
  Top 0.254: U6.13 16.76,30.75 17.34,30.17 17.34,27.34 16.76,26.77 U7.13
!RESET
  Top 0.2: MS1.1 38.86,44.58 36.8,42.52 36.8,34.52 33.47,31.2 U11.12
!RST  (via drill 0.25)
  Top 0.2: v23.11,31.88 28.89,31.88 U11.6
  Top 0.254: U6.10 v20.57,31.75 20.57,30.37 21.15,29.79 21.15,27.34 20.57,26.77 U7.10
  Bottom 0.2: v20.57,31.75 22.99,31.75 v23.11,31.88
AUX_EN
  Top 0.2: U4.1 68.21,41.29 67.97,41.05 67.97,40.55 67.83,40.41 65.53,40.41 | 65.53,40.41 65.26,40.41 64.49,41.18 62.47,41.18 60.7,42.95 43.4,42.95 40.28,46.07 38.59,46.07 38.11,45.59 38.1,45.59 36.1,43.59 36.1,34.82 34.68,33.4 U11.16 | U3.1 65.57,40.45 65.53,40.41
CLK  (via drill 0.25)
  Top 0.2: MS1.25 58.29,26.8 57.98,26.48 41.3,26.48 39.84,27.94 38.9,27.94 36.81,25.85 28.64,25.85 v28.39,26.1
  Top 0.254: U9.2 2.79,24.75 3.43,25.38 3.43,27.18 | U8.2 2.79,27.34 2.96,27.18 3.43,27.18 | v4.7,27.18 3.43,27.18
  Bottom 0.2: v4.7,27.18 4.85,27.02 8.18,27.02 8.54,26.67 27.82,26.67 v28.39,26.1
DATA  (via drill 0.25)
  Top 0.2: U9.9 v11.42,26.04 v11.43,26.04 | MS1.24 57.91,26.04 40.23,26.04 39.59,25.4 28.07,25.4 v27.82,25.66
  Bottom 0.2: v11.43,26.04 27.44,26.04 v27.82,25.66
F_IN  (via drill 0.25)
  Top 0.254: v41.78,21.97 42.04,21.72 MS1.23
  Bottom 0.254: J4.3 30.81,77.93 35.18,77.93 36.17,76.93 36.17,28.34 39.09,25.43 39.85,25.43 40.54,24.74 40.54,23.22 v41.78,21.97
GND  (via drill 0.25, 0.3, 0.35, 0.7)
  Top 0.2: U10.3 20.94,17.38 21.21,17.65 21.21,19.05 21.84,19.68 U7.8 21.84,21.46 21.21,22.1 15.49,22.1 | U7.12 18.03,26.92 18.29,27.18 19.56,27.18 19.94,26.8 19.94,25.37 20.32,24.99 21.05,24.99 21.29,25.23 21.29,26.75 21.84,27.3 U6.8 21.84,30.24 21.29,30.79 21.29,34.46 20.83,34.92 18.03,34.92 | 18.03,34.92 15.88,34.92 15.49,34.54 U6.14 15.49,32.89 15.37,32.77 12.45,32.77 12.19,33.02 12.19,34.19 11.56,34.83 9.42,34.83 9.14,34.55 U8.10 | U6.12 18.03,34.92 | U7.14 v15.49,24.13 15.49,22.1 | U8.8 10.41,29.73 8.74,31.4 2.82,31.4 2.79,31.37 | U9.8 10.41,19.57 11.16,18.82 15.39,18.82 16.05,19.48 16.05,21.15 15.49,21.7 15.49,22.1
  Top 0.254: 4.32,68.58 4.32,67.79 3.75,67.22 3.6,67.22 3.09,66.71 R11.2 3.09,64.98 3.68,64.39 C17.2 | 4.32,68.58 4.32,68.98 4.06,69.23 U2.3 3.49,69.62 3.98,70.1 R2.1 3.98,74.38 J1.1 | U12.2 4.32,68.58 | U9.15 2.79,26.77 2.1,27.46 2.1,28.91 v2.79,29.6 2.79,31.37 U8.15 2.79,34.91 C16.2 | v18.03,24.13 U7.12 | U13.8 U13.7 67.25,14.15 66.94,14.46 66.69,14.46 | v30.1,36.07 U11.23 | v18.03,35.69 18.03,34.92 | v29.22,26.41 28.9,26.41 28.57,26.73 28.57,27.31 31.61,30.34 | 31.61,30.34 U11.11 | v31.88,30.1 31.63,30.34 31.61,30.34 | v71.25,43.05 71.24,43.04 71.12,43.04 | U14.3 64.84,28.52 64.02,27.7 64.02,27.18 | 64.02,27.18 C13.2 64.02,22.84 J10.1 | 66.69,14.46 C12.2 | U13.3 66.6,14.55 66.69,14.46 | U14.8 63,27.18 64.02,27.18
  Top 0.305: v11.05,46.1 3.59,46.1 SD1.6 1.3,46.13 1.27,46.1 | v31.5,14.73 31.62,14.61 RTC1.5 | v67.82,11.56 67.9,11.64 U13.8 | U5.3 U5.2 62.61,67.44 | 62.61,67.44 61.01,67.44 60.46,67.99 60.46,69.72 60.45,69.72 60.8,70.08 60.8,70.09 61.7,70.98 61.71,70.98 62.61,71.88 J5.P1 | C11.2 62.63,67.42 62.61,67.44 | C2.2 51.83,68.89 R4.1 | RTC1.5 33.53,14.61 34.38,13.76 C10.2 34.8,12.7 BT1.GND | C15.2 32.13,12.95 32.64,13.46 RTC1.5 | SD1.MT3 16.26,49.53 15.35,50.43 SD1.MT4 4.04,50.42 2.03,50.42 1.27,49.66 1.27,46.1 | SD1.MT2 14.69,37.08 SD1.MT1 2.16,37.08 1.27,37.97 1.27,46.1
  Top 0.406: C5.2 66.93,43.04 | 66.93,43.04 69.14,43.04 | 69.14,43.04 R5.1 | U3.3 66.87,42.98 66.93,43.04 | 75.69,43.04 C7.2 71.12,43.04 70.36,43.04 | 75.69,43.04 77.91,43.04 R6.1 78.23,42.97 78.91,42.97 79.25,43.31 79.25,46.99 77.98,48.26 C8.2 | U4.3 75.64,42.98 75.69,43.04 | 70.36,43.04 69.14,43.04 | C6.2 68.96,48.26 70.36,46.86 70.36,43.04 | MS1.4 37.71,35.3 37.71,30.98 35.42,28.69 C14.2 32.06,28.69 arc45 31.97,28.65 29.73,26.41 v29.22,26.41 | U1.2 51.53,64.7 C3.2 v53.47,66.17 53.47,66.8 52.96,67.31 C2.2 | C4.2 44.96,62.74 v44.32,63.37
  Top 0.61: MS1.4 43.56,41.15 58.29,41.15 63.37,36.07 66.29,36.07 U$1.GND | Q1.2 12.13,66.23 v11.81,66.55
  Bottom 0.254: v2.79,29.6 2.79,27.31 5.98,24.13 v15.49,24.13 v18.03,24.13 | v30.1,36.07 30.1,31.88 v31.88,30.1 | 19.12,36.9 18.03,35.81 v18.03,35.69
  Bottom 0.305: XU1.GND 11.81,57.4 v11.81,66.55 | v11.05,46.1 11.05,44.18 14.34,40.89 15.13,40.89 19.12,36.9 27.1,28.92 27.1,27.95 27.7,27.36 27.91,27.36 28.71,26.56 29.07,26.56 v29.22,26.41 29.22,26.28 31.51,23.99 31.51,17.8 31.93,17.38 31.93,15.16 v31.5,14.73 30.23,13.46 26.02,13.46 24.95,14.53 24.07,14.53 23,13.46 J13.2 | 67.31,20.57 67.31,12.06 v67.82,11.56
  Bottom 0.406: v44.32,63.37 47.5,66.55 48.51,66.55 | v53.47,66.17 53.09,66.55 48.51,66.55 | 48.26,78.61 48.51,78.36 48.51,66.55
  Bottom 0.61: J10.1 66.29,20.57 67.31,20.57 68.58,20.57 J10.3 69.98,29.84 67.82,32 U$1.GND 67.82,39.62 v71.25,43.05 73.38,45.18 75.4,45.18 78.87,48.64 78.87,64.14 | 67.69,78.61 75.56,78.61 78.87,75.31 78.87,71.88 | 67.69,78.61 62.61,78.61 | 62.61,78.61 52.32,78.61 | 52.32,78.61 48.26,78.61 42.29,78.61 | 42.29,78.61 37.21,78.61 | 37.21,78.61 24.51,78.61 | 24.51,78.61 13.08,78.61 | 13.08,78.61 3.56,78.61 J1.1 | 78.87,64.14 78.87,71.88 | J4.1 24.51,78.61 | J7.1 42.29,78.61 | J8.1 52.45,78.49 52.32,78.61 | J5.P1 62.61,78.61 | J2.1 67.69,78.61 | J11.1 78.74,71.75 78.87,71.88 | J12.1 78.87,64.14 | v11.81,66.55 11.81,67.78 13.45,69.42 13.45,71.3 13.08,71.67 13.08,78.61 | J3.P1 37.21,78.61
  pour Bottom (no thermals): 43.56,64.39 43.56,68.83 45.72,70.99 52.32,70.99 53.09,70.23 54.23,69.09 54.23,63.37 53.21,62.36 44.45,62.36 43.56,63.25
  pour Top (no thermals): 51.31,70.36 51.31,65.53 50.67,64.9 50.67,64.26 50.8,64.14 52.32,64.14 52.58,63.88 54.23,63.88 54.48,64.14 54.48,68.83 52.83,70.48 51.44,70.48
HEATER_EN  (via drill 0.25)
  Top 0.254: U1.3 50.76,65.59 v50.24,65.07 | v43.18,55.88 35.31,48.01 35.31,35.56 34.14,34.4 U11.18
  Bottom 0.254: v50.24,65.07 50.24,61.67 44.45,55.88 v43.18,55.88
INTA  (via drill 0.25)
  Top 0.2: U11.14 33.64,32.4 v33.66,32.38 | v41.27,14.1 MS1.20
  Bottom 0.2: v33.66,32.38 33.66,27.97 38.77,22.86 39.84,22.86 40.92,21.78 40.92,14.45 v41.27,14.1
LOAD
  Top 0.2: 19.05,18.03 19.05,17.14 19.24,16.96 22.66,16.96 23.37,17.66 23.37,28.19 26.37,31.2 U11.7
  Top 0.254: U8.1 1.52,27.34 2.1,26.76 2.1,22.79 1.52,22.21 U9.1 1.52,19.3 2.79,18.03 19.05,18.03 U10.2
MISO
  Top 0.254: XU1.SDO 20.7,48.01 18.95,46.25 18.46,46.25 17.28,45.07 15.38,45.07 13.22,47.23 SD1.7
  Bottom 0.254: MS1.13 39.37,14.98 40.54,16.15 40.54,19.66 39.85,20.34 38.84,20.34 20.7,38.48 XU1.SDO
MOSI  (via drill 0.25)
  Top 0.254: XU1.SDI 23.27,53.57 23.27,47.14 20.57,44.45 18.73,44.45 v18.28,44 18.03,43.75 15.43,43.75 14.51,42.83 SD1.3
  Bottom 0.254: MS1.12 37.97,18.03 37.97,19.81 18.28,39.5 v18.28,44
N$1
  Top 0.406: R3.1 46.92,65.29 C1.2
  Top 0.61: VR1.1 45.34,66.86 C1.2
N$2
  Top 0.305: U5.4 61.26,69.9 61.89,70.52 R8.2 65.11,70.52 65.79,69.85 C9.1
N$3
  Top 0.305: VR1.2 49.39,70.03 R4.2 50.53,68.89 C2.1 50.53,66.15 49.97,65.59 U1.4
  pour Top (rank 2, no thermals): 50.16,71.12 50.8,70.48 50.8,66.17 49.66,65.02 48.26,65.02 47.88,65.41 47.88,66.17 47.5,66.55 47.5,68.21 46.87,68.83 45.97,68.83 45.34,69.46 45.34,70.61 45.85,71.12
N$4
  Top 0.305: R6.2 78.11,45.43 77.44,46.09 U4.5
N$5
  Top 0.305: R5.2 69.34,45.43 68.68,46.09 U3.5
N$6
  Top 0.406: U1.5 48.87,63.44 49.92,62.39 L1.P$1
  pour Top (rank 2, no thermals): 48.13,64.39 48.13,63.12 48.77,62.48 48.77,58.67 49.15,58.29 50.8,58.29 51.05,58.55 51.05,62.36 49.66,63.75 49.66,64.26 49.4,64.52 48.26,64.52
N$7
  Top 0.2: U9.11 7.87,25.15 8.19,24.84 13.91,24.84 14.22,25.15 U7.15
N$8
  Top 0.2: U9.12 6.6,25.02 7.14,24.48 9.66,24.48 11.75,22.39 11.75,20.89 12.19,20.45 U7.1
N$9
  Top 0.2: U7.2 14.22,19.68 14.1,19.56 11.55,19.56 11.4,19.7 11.4,21.99 9.26,24.13 6.48,24.13 5.33,25.27 U9.13
N$10
  Top 0.2: U9.14 4.06,25.15 5.59,23.62 9.15,23.62 11.05,21.72 11.05,19.43 11.3,19.18 15.24,19.18 15.49,19.43 U7.3
N$11  (via drill 0.25)
  Top 0.2: U9.3 v4.06,21.59 | v16.76,21.46 U7.4
  Bottom 0.2: v4.06,21.59 16.64,21.59 v16.76,21.46
N$12  (via drill 0.25)
  Top 0.2: U9.4 v5.33,22.1 | v18.03,21.46 U7.5
  Bottom 0.2: v5.33,22.1 17.4,22.1 v18.03,21.46
N$13  (via drill 0.25)
  Top 0.2: U9.5 v6.6,22.6 | v19.3,21.46 U7.6
  Bottom 0.2: v6.6,22.6 18.16,22.6 v19.3,21.46
N$14  (via drill 0.25)
  Top 0.2: U9.6 v7.87,23.11 | v20.57,21.46 U7.7
  Bottom 0.2: v7.87,23.11 18.93,23.11 v20.57,21.46
N$15  (via drill 0.25)
  Top 0.2: U8.6 v7.87,30.86 | v20.57,29.21 U6.7
  Bottom 0.2: v7.87,30.86 8.13,31.11 18.67,31.11 v20.57,29.21
N$16  (via drill 0.25)
  Top 0.2: U8.5 v6.6,30.35 | v19.3,29.21 U6.6
  Bottom 0.2: v6.6,30.35 8.12,30.35 8.51,30.73 17.78,30.73 v19.3,29.21
N$17  (via drill 0.25)
  Top 0.2: U8.4 v5.33,29.84 | v18.03,29.21 U6.5
  Bottom 0.2: v5.33,29.84 8.12,29.84 8.65,30.38 16.86,30.38 v18.03,29.21
N$18  (via drill 0.25)
  Top 0.2: U8.3 v4.06,29.34 | v16.76,29.21 U6.4
  Bottom 0.2: v4.06,29.34 8.11,29.34 8.8,30.03 15.95,30.03 v16.76,29.21
N$19
  Top 0.2: U8.14 4.06,32.77 5.08,31.75 8.89,31.75 11.05,29.59 11.05,27.56 11.68,26.92 15.37,26.92 15.49,27.05 U6.3
N$20
  Top 0.2: U8.13 5.33,32.51 5.71,32.13 9.01,32.13 11.4,29.74 11.4,27.7 11.83,27.28 14.1,27.28 14.22,27.4 U6.2
N$21
  Top 0.2: U8.12 6.6,32.77 6.89,32.48 9.15,32.48 11.75,29.88 11.75,28.25 11.88,28.13 12.89,28.13 | U6.1 12.89,28.13 | 12.89,28.13 12.83,28.07
N$22
  Top 0.2: U8.11 7.87,34.8 8.61,35.53 13.36,35.53 14.22,34.67 U6.15
N$23  (via drill 0.25)
  Top 0.2: U8.9 10.41,31.72 12.11,30.03 12.11,29.57 v12.38,29.3 | v9.78,27.18 9.27,27.18 9.14,27.05 U9.10
  Bottom 0.2: v12.38,29.3 10.25,27.18 v9.78,27.18
N$24
  Top 0.2: U7.11 19.3,25.27 19.94,24.64 21.84,24.64 22.61,25.4 22.61,29.98 21.84,30.74 U6.9
N$30
  Top 0.305: RTC1.6 33.66,15.88 34.08,15.46 C10.1 35.6,15.46 36.2,14.86 BT1.POWER0 36.2,3.56 33.73,1.09 23.42,1.09 20.95,3.56 BT1.POWER1
PULSE_DIG  (via drill 0.25)
  Top 0.254: U12.4 7.17,67.37 v6.99,67.18 | v19.3,32.38 U6.11
  Bottom 0.254: v6.99,67.18 6.99,57.91 10.26,54.63 10.97,54.63 11.58,54.02 11.58,47.42 10.49,46.33 10.49,41.2 v19.3,32.38
PYRO
  Top 0.305: JP1.1 69.47,67.97 69.03,68.41 R7.1 67.94,70.23 65.95,72.22 R8.1 63.63,73.24 65.15,74.76 J5.P2
PYRO_AMP  (via drill 0.25)
  Top 0.254: v65.79,65.15 C9.2
  Top 0.305: U5.1 64.72,66.49 64.95,66.71 C9.2 R7.2 69.03,66.71 69.47,67.16 JP1.2
  Bottom 0.254: MS1.5 48.77,34.42 53.42,39.06 53.42,50.86 65.79,63.23 v65.79,65.15
RAIN_TIP  (via drill 0.25)
  Top 0.2: MS1.21 60.96,17.91 60.96,37.69 58.22,40.44 v52.32,40.44
  Top 0.254: R1.1 37.63,74.59 J3.P2
  Bottom 0.2: v52.32,40.44 39.75,53.01 J3.P2
RX
  Bottom 0.254: J13.4 18.8,11.56 MS1.14
S0  (via drill 0.25)
  Top 0.2: v33.17,54.99 33.17,54.63 32.23,53.69 32.23,53.03 27.98,48.78 27.98,34.56 28.15,34.4 U11.1
  Bottom 0.2: J4.5 34.67,56.49 v33.17,54.99
S1  (via drill 0.25)
  Top 0.2: U11.2 27.89,33.9 27.63,34.16 27.63,48.93 31.88,53.17 31.88,54.35 v32.51,54.99
  Bottom 0.2: v32.51,54.99 32.51,76.33 J4.4
SAP_CS
  Bottom 0.254: MS1.10 25.78,35.31 XU1.CS
SAP_FAULT
  Top 0.2: U11.4 27.43,32.9 26.92,33.4 26.92,52.2 XU1.FLT
SAP_HEATER+
  Top 0.406: C4.1 47.18,60.01 L1.P$2 47.62,63.29 R3.2 46.92,63.99 C1.1
  Top 0.61: J6.2 17.3,76.3 D1.CAT 17.3,65.64 22.92,60.01 C4.1
  pour Top (no thermals): 44.2,64.52 47.88,64.52 48.01,64.39 48.01,62.99 48.64,62.36 48.64,58.67 48.26,58.29 44.07,58.29 43.69,58.67 43.69,64.01
SAP_HEATER-
  Top 0.61: J6.1 13.95,76.3 D1.ANODE 15.2,70.25 Q1.3
SAP_HEATER_SW  (via drill 0.25)
  Top 0.254: v35.81,24.26 MS1.9 | Q1.1 13.1,67.2 v13.08,67.18
  Bottom 0.254: v35.81,24.26 21.84,38.23 21.84,57.4 21.84,57.53 21.84,58.42 v13.08,67.18
SAP_READY
  Top 0.2: XU1.DRDY 27.28,50.01 27.28,33.97 27.84,33.4 U11.3
SAP_THERM+
  Top 0.61: XU1.THERM+ 18.95,71.12 19.43,71.6 J6.3
SAP_THERM-
  Top 0.61: XU1.THERM- 22.45,71.12 21.97,71.6 J6.4
SCK  (via drill 0.25)
  Top 0.254: v18.8,45.72 18.67,45.59 18.38,45.59 17.45,44.66 7.41,44.66 7.04,45.03 SD1.5
  Bottom 0.254: XU1.SCK 18.16,46.35 v18.8,45.72 19.18,45.34 19.18,39.37 MS1.11
SCL  (via drill 0.25)
  Top 0.2: U14.5 62.92,29.12 61.9,29.12 61.34,28.56 61.34,12.8 | U13.5 61.34,12.8 | 61.34,12.8 61.34,10.58 59.78,9.02 MS1.18 | U11.9 30.61,30.38 27.84,27.61 27.84,26.9 26.91,25.97 26.91,21.98 30.5,18.39 31.07,18.39 31.09,18.41 RTC1.8
  Top 0.254: MS1.18 57.91,9.02 56.74,10.19 v53.47,10.19 38.58,10.19 37.85,10.92 37.85,16 35.43,18.41 RTC1.8 | J8.4 58.04,74.68 58.04,54.61 v59.69,52.96
  Bottom 0.254: J7.4 51.31,75.31 58.67,75.31 J8.4 | v53.47,10.19 53.47,34.73 56.03,37.3 56.03,49.31 v59.69,52.96
SD_CD
  Top 0.2: R41.1 19.8,42.04 | U11.5 25.26,32.4 19.8,37.85 19.8,42.04 | SD1.CD 19.8,42.03 19.8,42.04
SD_CS  (via drill 0.25)
  Top 0.2: MS1.22 40.98,19.18 39.84,20.32 37.21,20.32 34.54,22.99 33.92,22.99 v32.9,24.01 | v14.86,41.91 6.35,41.91 5.95,41.91 5.46,41.91 5.29,41.73 SD1.2
  Bottom 0.2: v32.9,24.01 31.62,25.28 31.62,25.61 15.33,41.91 v14.86,41.91
SDA  (via drill 0.25)
  Top 0.152: v31.37,17.14 RTC1.7
  Top 0.2: U14.6 62.05,28.52 61.72,28.19 61.72,13.55 v61.97,13.3 65.28,13.3 65.57,13.6 66.41,13.6 66.6,13.41 U13.6 | U11.10 31.11,30.38 28.2,27.46 28.2,26.75 27.31,25.87 27.31,22.45 v30.86,18.9
  Top 0.254: MS1.17 56.92,9.25 v51.69,9.25 41.25,9.25 39.85,7.85 38.89,7.85 38.2,8.53 38.2,9.99 37.44,10.75 37.44,15.62 35.92,17.14 RTC1.7 | J7.3 48.77,75.31 57.53,75.31 | 57.53,76.58 J8.3 57.53,75.31 | v57.5,52.45 57.53,52.48 57.53,75.31
  Bottom 0.152: v30.86,18.9 30.86,17.65 v31.37,17.14
  Bottom 0.2: v61.97,13.3 61.97,11.97 60.16,10.16 59.22,10.16 58.55,9.49 58.55,8.54 59.69,7.4 MS1.17
  Bottom 0.254: v51.69,9.25 51.69,33.72 55.52,37.55 55.52,50.47 v57.5,52.45
SOIL_1
  Bottom 0.254: MS1.8 42.55,26.8 54.23,38.48 54.23,50.42 65.41,61.59 J12.2
SOIL_2
  Bottom 0.254: MS1.7 44.32,29.34 53.82,38.84 53.82,50.69 72.35,69.22 J11.2
TX
  Bottom 0.254: J13.5 18.8,9.02 MS1.15
VBAT
  Top 0.305: U14.1 66.95,27.22 67.47,26.7 R12.2 | U13.2 67.25,16.63 R9.1
  Top 0.61: R9.1 66.61,18.73 67.44,19.56 J10.2 67.47,22 67.47,26.7
VMAIN
  Top 0.305: U14.2 66.92,27.87 R12.1
  Top 0.61: U$1.VIN 67.56,34.8 R12.1
VREF
  Top 0.254: R10.1 R11.1 4.79,67.06 5.27,67.55 U12.3
VSOLAR
  Top 0.305: U13.1 67.9,16.66 68.48,17.24 R9.2
  Top 0.61: J10.4 72.52,20 69.75,17.24 68.48,17.24
WATER_DEPTH
  Top 0.254: U2.2 2.79,68.58 2.67,68.71 2.67,73.66 0.61,75.72 0.61,77.32 1.65,78.36 5.08,78.36 J1.3
WATER_DEPTH_3V3  (via drill 0.25)
  Top 0.254: v36.83,58.42 5.21,58.42 0.91,62.72 0.91,68.22 1.59,68.9 U2.4
  Bottom 0.254: MS1.6 36.83,34.42 v36.83,58.42
WATER_TEMP  (via drill 0.25)
  Top 0.254: J2.3 72.77,74.21 71.72,73.15 R13.1 71.72,69.72 72.26,69.18 v72.26,59.69
  Bottom 0.254: MS1.19 61.44,13.31 61.44,30.15 66.4,35.1 66.4,40.69 66.97,41.27 66.97,54.4 v72.26,59.69
WIND_PULSE
  Top 0.254: U12.1 5.27,69.74 5.68,70.14 R2.2 6.95,70.74 9.27,73.06 J9.P1

### Text on the board
tDocu: WT | GND | 5v | WD | Wind | 3v3 | H- | H+ | T+ | T- | GND | 3v3 | Fin | S1 | S0 | GND | Tip | GND | 3v3 | SDA | SCL | GND | 3v3 | SDA | SCL | GND | Pyro | GND | 3v3 | GND | Soil1 | 3v3 | GND | Soil2 | 3v3